# EAGLE design wally (EAGLE 9.6.2)
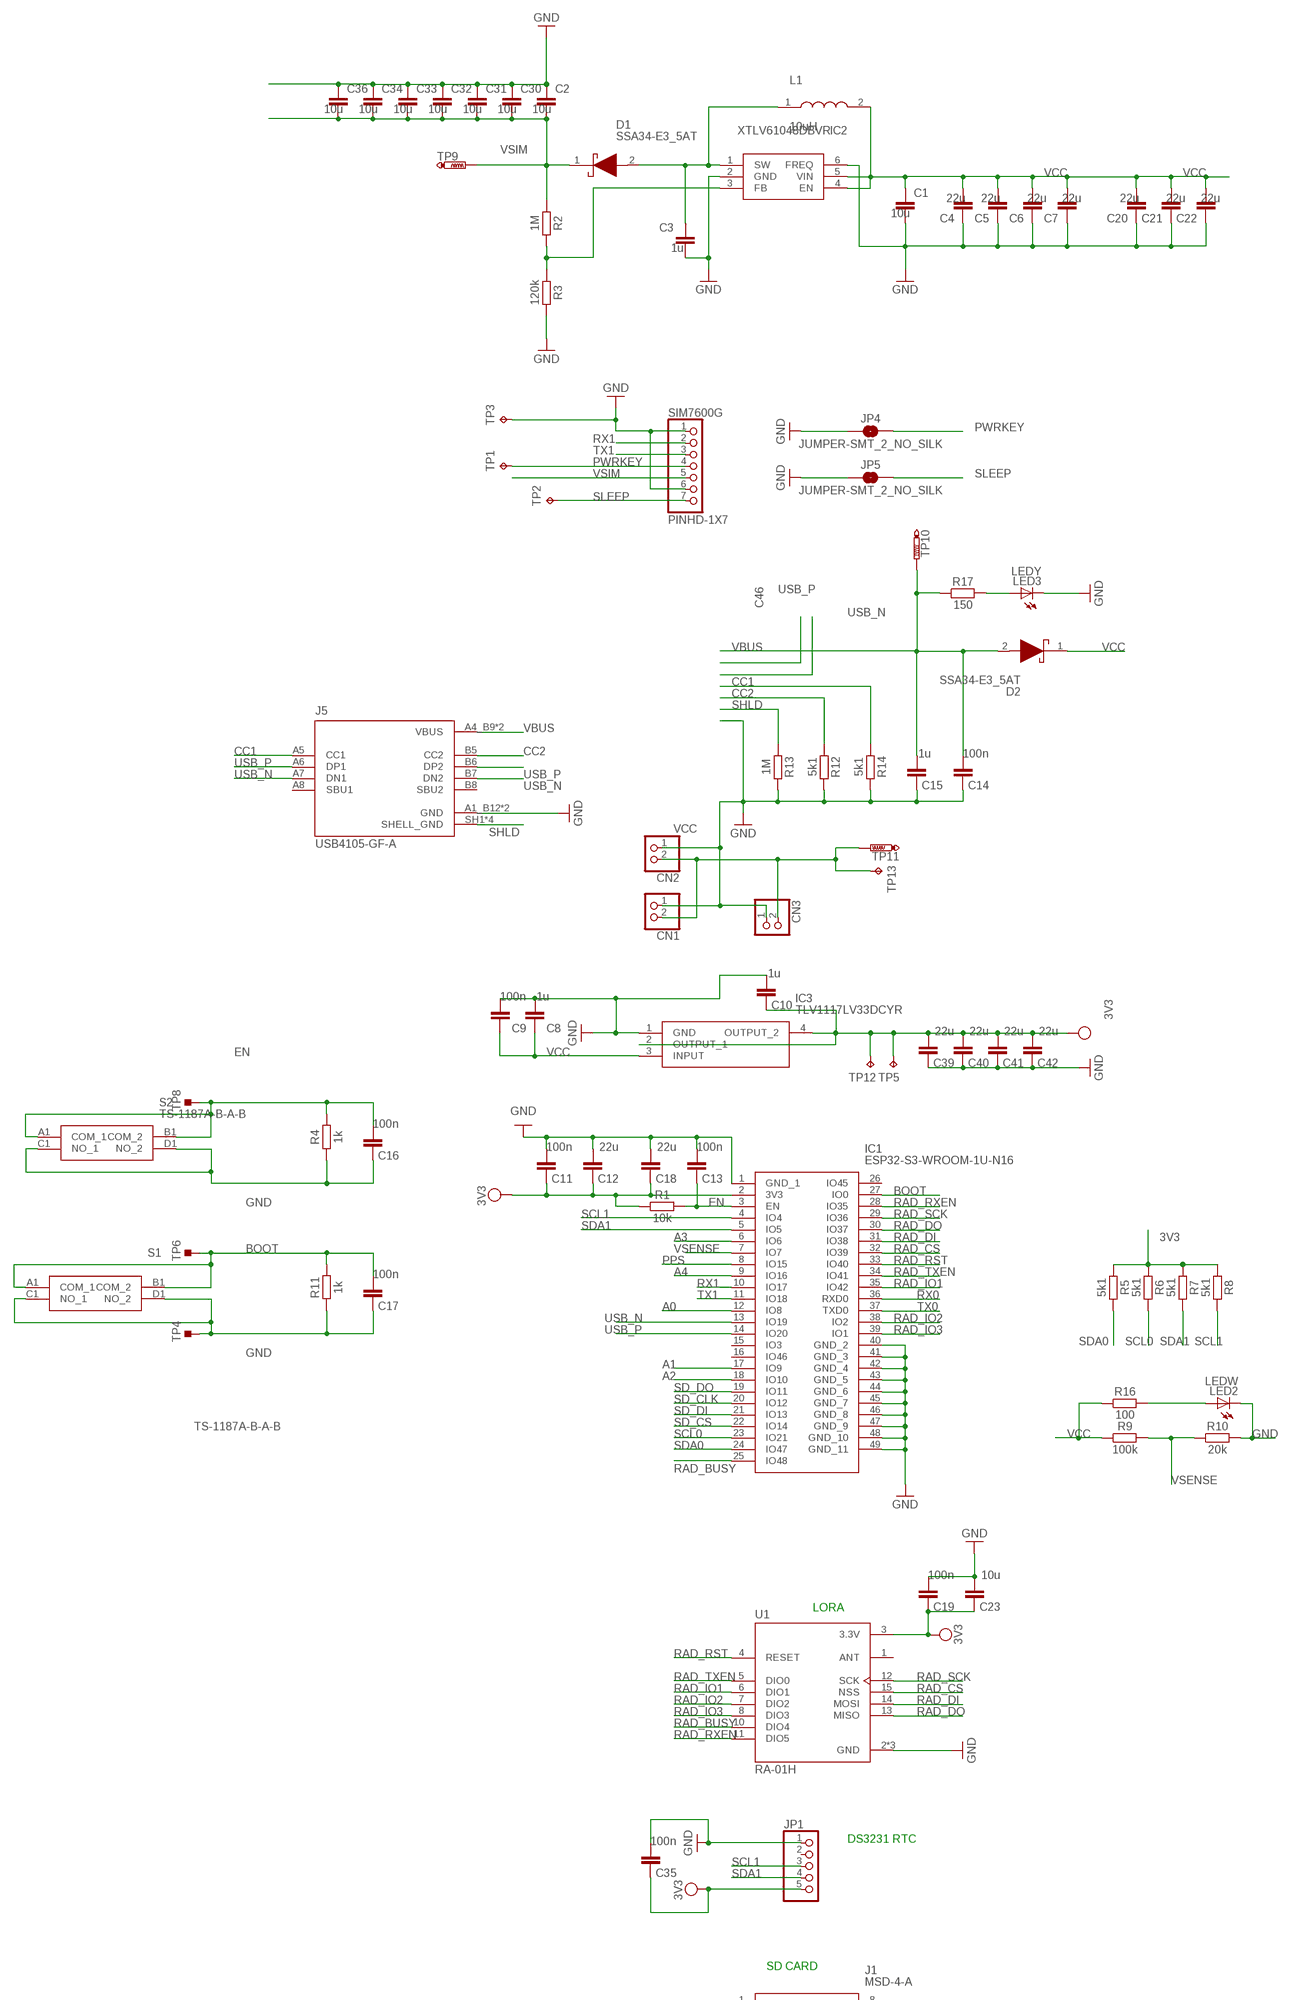
[diagram p0: schematic, sheet 1, part 1 of 2]
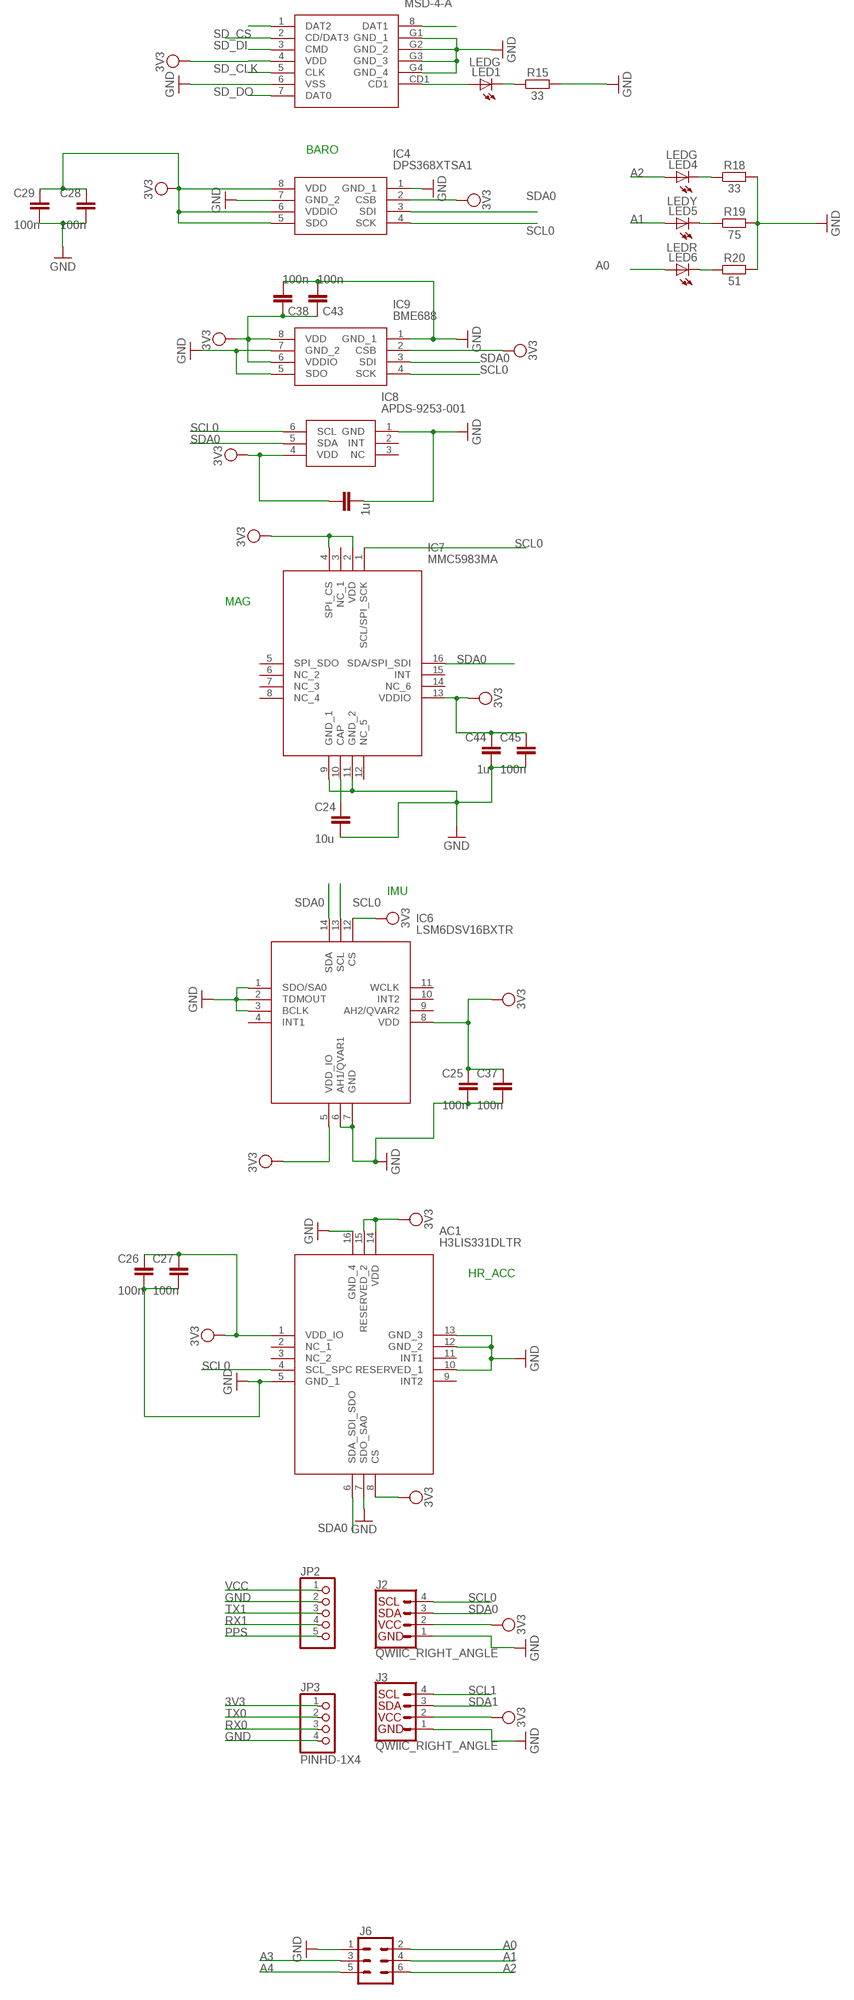
[diagram p1: schematic, sheet 1, part 2 of 2]

## Parts
AC1  H3LIS331DLTR  [LIS3DHTR]
C1  10u  C_CHIP-0402(1005-METRIC)  [CAPC1005X60]
C2  10u  C_CHIP-0603(1608-METRIC)  [CAPC1608X85]
C3  1u  C_CHIP-0402(1005-METRIC)  [CAPC1005X60]
C4  22u  C_CHIP-0603(1608-METRIC)  [CAPC1608X85]
C5  22u  C_CHIP-0603(1608-METRIC)  [CAPC1608X85]
C6  22u  C_CHIP-0603(1608-METRIC)  [CAPC1608X85]
C7  22u  C_CHIP-0603(1608-METRIC)  [CAPC1608X85]
C8  1u  C_CHIP-0402(1005-METRIC)  [CAPC1005X60]
C9  100n  C_CHIP-0402(1005-METRIC)  [CAPC1005X60]
C10  1u  C_CHIP-0402(1005-METRIC)  [CAPC1005X60]
C11  100n  C_CHIP-0402(1005-METRIC)  [CAPC1005X60]
C12  22u  C_CHIP-0603(1608-METRIC)  [CAPC1608X85]
C13  100n  C_CHIP-0402(1005-METRIC)  [CAPC1005X60]
C14  100n  C_CHIP-0402(1005-METRIC)  [CAPC1005X60]
C15  1u  C_CHIP-0402(1005-METRIC)  [CAPC1005X60]
C16  100n  C_CHIP-0402(1005-METRIC)  [CAPC1005X60]
C17  100n  C_CHIP-0402(1005-METRIC)  [CAPC1005X60]
C18  22u  C_CHIP-0603(1608-METRIC)  [CAPC1608X85]
C19  100n  C_CHIP-0402(1005-METRIC)  [CAPC1005X60]
C20  22u  C_CHIP-0603(1608-METRIC)  [CAPC1608X85]
C21  22u  C_CHIP-0603(1608-METRIC)  [CAPC1608X85]
C22  22u  C_CHIP-0603(1608-METRIC)  [CAPC1608X85]
C23  10u  C_CHIP-0402(1005-METRIC)  [CAPC1005X60]
C24  10u  C_CHIP-0402(1005-METRIC)  [CAPC1005X60]
C25  100n  C_CHIP-0402(1005-METRIC)  [CAPC1005X60]
C26  100n  C_CHIP-0402(1005-METRIC)  [CAPC1005X60]
C27  100n  C_CHIP-0402(1005-METRIC)  [CAPC1005X60]
C28  100n  C_CHIP-0402(1005-METRIC)  [CAPC1005X60]
C29  100n  C_CHIP-0402(1005-METRIC)  [CAPC1005X60]
C30  10u  C_CHIP-0603(1608-METRIC)  [CAPC1608X85]
C31  10u  C_CHIP-0603(1608-METRIC)  [CAPC1608X85]
C32  10u  C_CHIP-0603(1608-METRIC)  [CAPC1608X85]
C33  10u  C_CHIP-0603(1608-METRIC)  [CAPC1608X85]
C34  10u  C_CHIP-0603(1608-METRIC)  [CAPC1608X85]
C35  100n  C_CHIP-0402(1005-METRIC)  [CAPC1005X60]
C36  10u  C_CHIP-0603(1608-METRIC)  [CAPC1608X85]
C37  100n  C_CHIP-0402(1005-METRIC)  [CAPC1005X60]
C38  100n  C_CHIP-0402(1005-METRIC)  [CAPC1005X60]
C39  22u  C_CHIP-0603(1608-METRIC)  [CAPC1608X85]
C40  22u  C_CHIP-0603(1608-METRIC)  [CAPC1608X85]
C41  22u  C_CHIP-0603(1608-METRIC)  [CAPC1608X85]
C42  22u  C_CHIP-0603(1608-METRIC)  [CAPC1608X85]
C43  100n  C_CHIP-0402(1005-METRIC)  [CAPC1005X60]
C44  1u  C_CHIP-0402(1005-METRIC)  [CAPC1005X60]
C45  100n  C_CHIP-0402(1005-METRIC)  [CAPC1005X60]
C46  1u  C_CHIP-0402(1005-METRIC)  [CAPC1005X60]
CN1  JST_2PIN-THM-RA  [JST-PH-2-THM-RA]
CN2  JST_2PIN-THM-RA  [JST-PH-2-THM-RA]
CN3  JST_2PIN-THM-RA  [JST-PH-2-THM-RA]
D1  SSA34-E3_5AT  [DIOM5127X229N]
D2  SSA34-E3_5AT  [DIOM5127X229N]
IC1  ESP32-S3-WROOM-1U-N16  [ESP32S3WROOM1UN16]
IC2  XTLV61048DBVR  [SOT95P280X145-6N]
IC3  TLV1117LV33DCYR  [SOT230P700X180-4N]
IC4  DPS368XTSA1  [DPS368XTSA1]
IC6  LSM6DSV16BXTR  [LSM6DSV16BXTR]
IC7  MMC5983MA  [MMC5983MA]
IC8  APDS-9253-001  [APDS9253001]
IC9  BME688  [BME688]
J1  MSD-4-A  [MSD4A]
J2  QWIIC_RIGHT_ANGLE  QWIIC_CONNECTORJS-1MM  [JST04_1MM_RA]
J3  QWIIC_RIGHT_ANGLE  QWIIC_CONNECTORJS-1MM  [JST04_1MM_RA]
J5  USB4105-GF-A  [GCT_USB4105-GF-A]
J6  FEMALE 2x3  CONN_03X2NO_SILK  [2X3-NS]
JP1  PINHD-1X5  [1X05]
JP2  PINHD-1X5  [1X05]
JP3  PINHD-1X4  [1X04]
JP4  JUMPER-SMT_2_NO_SILK  [SMT-JUMPER_2_NO_SILK]
JP5  JUMPER-SMT_2_NO_SILK  [SMT-JUMPER_2_NO_SILK]
L1  10uH  BMRF00060630100MA1  [BMRF00060630100MA1]
LED1  LEDG  LEDCHIPLED_0805  [CHIPLED_0805]
LED2  LEDW  LEDCHIPLED_0805  [CHIPLED_0805]
LED3  LEDY  LEDCHIPLED_0805  [CHIPLED_0805]
LED4  LEDG  LEDCHIPLED_0805  [CHIPLED_0805]
LED5  LEDY  LEDCHIPLED_0805  [CHIPLED_0805]
LED6  LEDR  LEDCHIPLED_0805  [CHIPLED_0805]
R1  10k  R_CHIP-0402(1005-METRIC)  [RESC1005X40]
R2  1M  R_CHIP-0603(1608-METRIC)  [RESC1608X60]
R3  120k  R_CHIP-0603(1608-METRIC)  [RESC1608X60]
R4  1k  R_CHIP-0402(1005-METRIC)  [RESC1005X40]
R5  5k1  R_CHIP-0402(1005-METRIC)  [RESC1005X40]
R6  5k1  R_CHIP-0402(1005-METRIC)  [RESC1005X40]
R7  5k1  R_CHIP-0402(1005-METRIC)  [RESC1005X40]
R8  5k1  R_CHIP-0402(1005-METRIC)  [RESC1005X40]
R9  100k  R_CHIP-0402(1005-METRIC)  [RESC1005X40]
R10  20k  R_CHIP-0402(1005-METRIC)  [RESC1005X40]
R11  1k  R_CHIP-0402(1005-METRIC)  [RESC1005X40]
R12  5k1  R_CHIP-0603(1608-METRIC)  [RESC1608X60]
R13  1M  R_CHIP-0402(1005-METRIC)  [RESC1005X40]
R14  5k1  R_CHIP-0603(1608-METRIC)  [RESC1608X60]
R15  33  R_CHIP-0402(1005-METRIC)  [RESC1005X40]
R16  100  R_CHIP-0402(1005-METRIC)  [RESC1005X40]
R17  150  R_CHIP-0603(1608-METRIC)  [RESC1608X60]
R18  33  R_CHIP-0402(1005-METRIC)  [RESC1005X40]
R19  75  R_CHIP-0603(1608-METRIC)  [RESC1608X60]
R20  51  R_CHIP-0603(1608-METRIC)  [RESC1608X60]
S1  TS-1187A-B-A-B  [TS1187ABAB]
S2  TS-1187A-B-A-B  [TS1187ABAB]
SIM7600G  PINHD-1X7  [1X07]
TP1  TPPAD1-13  [P1-13]
TP2  TPPAD1-13  [P1-13]
TP3  TPPAD1-13  [P1-13]
TP4  TESTPOINT_TPS-PAD-036  [TESTPOINT_PAD-036]
TP5  TPPAD1-13  [P1-13]
TP6  TESTPOINT_TPS-PAD-036  [TESTPOINT_PAD-036]
TP8  TESTPOINT_TPS-PAD-036  [TESTPOINT_PAD-036]
TP9  PTR1PAD1-13  [P1-13]
TP10  PTR1PAD1-13  [P1-13]
TP11  PTR1PAD1-13  [P1-13]
TP12  TPPAD1-13  [P1-13]
TP13  TPPAD1-13  [P1-13]
U1  RA-01H  [XCVR_RA-01H]

## Nets
3V3: AC1.1(VDD_IO) AC1.8(CS) AC1.14(VDD) AC1.15(RESERVED_2) C10.1 C11.1 C12.1 C18.1 C19.1 C23.1 C25.1 C26.1 C27.1 C28.1 C29.1 C35.1 C37.1 C38.1 C39.2 C40.2 C41.2 C42.2 C43.1 C44.1 C45.1 C46.1 IC1.2(3V3) IC3.2(OUTPUT_1) IC3.4(OUTPUT_2) IC4.2(CSB) IC4.5(SDO) IC4.6(VDDIO) IC4.8(VDD) IC6.5(VDD_IO) IC6.8(VDD) IC6.12(CS) IC7.2(VDD) IC7.4(SPI_CS) IC7.13(VDDIO) IC8.4(VDD) IC9.2(CSB) IC9.6(VDDIO) IC9.8(VDD) J1.4(VDD) J2.2 J3.2 JP1.5 JP3.1 R1.1 R5.1 R6.1 R7.1 R8.1 TP5.TP TP12.TP U1.3(3.3V)
A0: IC1.12(IO8) J6.2 LED6.A
A1: IC1.17(IO9) J6.4 LED5.A
A2: IC1.18(IO10) J6.6 LED4.A
A3: IC1.6(IO6) J6.3
A4: IC1.9(IO16) J6.5
BOOT: C17.2 IC1.27(IO0) R11.2 S1.A1(COM_1) S1.B1(COM_2) TP6.1(TP)
CC1: J5.A5(CC1) R14.1
CC2: J5.B5(CC2) R12.1
EN: C13.1 C16.2 IC1.3(EN) R1.2 R4.2 S2.A1(COM_1) S2.B1(COM_2) TP8.1(TP)
GND: AC1.5(GND_1) AC1.7(SDO_SA0) AC1.10(RESERVED_1) AC1.12(GND_2) AC1.13(GND_3) AC1.16(GND_4) C1.2 C2.1 C3.2 C4.1 C5.1 C6.1 C7.1 C8.2 C9.2 C10.2 C11.2 C12.2 C13.2 C14.1 C15.1 C16.1 C17.1 C18.2 C19.2 C20.1 C21.1 C22.1 C23.2 C24.2 C25.2 C26.2 C27.2 C28.2 C29.2 C30.1 C31.1 C32.1 C33.1 C34.1 C35.2 C36.1 C37.2 C38.2 C39.1 C40.1 C41.1 C42.1 C43.2 C44.2 C45.2 C46.2 CN1.1 CN2.1 CN3.1 IC1.1(GND_1) IC1.40(GND_2) IC1.41(GND_3) IC1.42(GND_4) IC1.43(GND_5) IC1.44(GND_6) IC1.45(GND_7) IC1.46(GND_8) IC1.47(GND_9) IC1.48(GND_10) IC1.49(GND_11) IC2.2(GND) IC2.6(FREQ) IC3.1(GND) IC4.1(GND_1) IC4.7(GND_2) IC6.1(SDO/SA0) IC6.2(TDMOUT) IC6.3(BCLK) IC6.6(AH1/QVAR1) IC6.7(GND) IC7.9(GND_1) IC7.11(GND_2) IC8.1(GND) IC9.1(GND_1) IC9.5(SDO) IC9.7(GND_2) J1.6(VSS) J1.G1(GND_1) J1.G2(GND_2) J1.G3(GND_3) J1.G4(GND_4) J2.1 J3.1 J5.A1_B12(GND) J5.B1_A12(GND) J6.1 JP1.1 JP2.2 JP3.4 JP4.1 JP5.1 LED2.C LED3.C R3.2 R4.1 R10.2 R11.1 R12.2 R13.2 R14.2 R15.2 R18.2 R19.2 R20.2 S1.C1(NO_1) S1.D1(NO_2) S2.C1(NO_1) S2.D1(NO_2) SIM7600G.1 SIM7600G.6 TP3.TP TP4.1(TP) U1.2(GND) U1.9(GND) U1.16(GND)
N$1: LED1.C R15.1
N$2: C3.1 D1.2(A) IC2.1(SW) L1.1
N$3: IC2.3(FB) R2.2 R3.1
N$4: LED3.A R17.2
N$6: C24.1 IC7.10(CAP)
N$7: LED4.C R18.1
N$8: LED5.C R19.1
N$9: LED2.A R16.2
N$10: J1.8(DAT1)
N$11: LED6.C R20.1
N$13: J1.1(DAT2)
N$49: J1.CD1 LED1.A
PPS: IC1.8(IO15) JP2.5
PWRKEY: JP4.2 SIM7600G.4 TP1.TP
RAD_BUSY: IC1.25(IO48) U1.10(DIO4)
RAD_CS: IC1.32(IO39) U1.15(NSS)
RAD_DI: IC1.31(IO38) U1.14(MOSI)
RAD_DO: IC1.30(IO37) U1.13(MISO)
RAD_IO1: IC1.35(IO42) U1.6(DIO1)
RAD_IO2: IC1.38(IO2) U1.7(DIO2)
RAD_IO3: IC1.39(IO1) U1.8(DIO3)
RAD_RST: IC1.33(IO40) U1.4(RESET)
RAD_RXEN: IC1.28(IO35) U1.11(DIO5)
RAD_SCK: IC1.29(IO36) U1.12(SCK)
RAD_TXEN: IC1.34(IO41) U1.5(DIO0)
RX0: IC1.36(RXD0) JP3.3
RX1: IC1.10(IO17) JP2.4 SIM7600G.2
SCL0: AC1.4(SCL_SPC) IC1.23(IO21) IC4.4(SCK) IC6.13(SCL) IC7.1(SCL/SPI_SCK) IC8.6(SCL) IC9.4(SCK) J2.4 R6.2
SCL1: IC1.4(IO4) J3.4 JP1.3 R8.2
SD_CLK: IC1.20(IO12) J1.5(CLK)
SD_CS: IC1.22(IO14) J1.2(CD/DAT3)
SD_DI: IC1.21(IO13) J1.3(CMD)
SD_DO: IC1.19(IO11) J1.7(DAT0)
SDA0: AC1.6(SDA_SDI_SDO) IC1.24(IO47) IC4.3(SDI) IC6.14(SDA) IC7.16(SDA/SPI_SDI) IC8.5(SDA) IC9.3(SDI) J2.3 R5.2
SDA1: IC1.5(IO5) J3.3 JP1.4 R7.2
SHLD: J5.SH1(SHELL_GND) J5.SH2(SHELL_GND) J5.SH3(SHELL_GND) J5.SH4(SHELL_GND) R13.1
SLEEP: JP5.2 SIM7600G.7 TP2.TP
TX0: IC1.37(TXD0) JP3.2
TX1: IC1.11(IO18) JP2.3 SIM7600G.3
USB_N: IC1.13(IO19) J5.A7(DN1) J5.B7(DN2)
USB_P: IC1.14(IO20) J5.A6(DP1) J5.B6(DP2)
VBUS: C14.2 C15.2 D2.2(A) J5.A4_B9(VBUS) J5.B4_A9(VBUS) R17.1 TP10.TP
VCC: C1.1 C4.2 C5.2 C6.2 C7.2 C8.1 C9.1 C20.2 C21.2 C22.2 CN1.2 CN2.2 CN3.2 D2.1(K) IC2.4(EN) IC2.5(VIN) IC3.3(INPUT) JP2.1 L1.2 R9.1 R16.1 TP11.TP TP13.TP
VSENSE: IC1.7(IO7) R9.2 R10.1
VSIM: C2.2 C30.2 C31.2 C32.2 C33.2 C34.2 C36.2 D1.1(K) R2.1 SIM7600G.5 TP9.TP
Unconnected: AC1.2(NC_1) AC1.3(NC_2) AC1.9(INT2) AC1.11(INT1) IC1.15(IO3) IC1.16(IO46) IC1.26(IO45) IC6.4(INT1) IC6.9(AH2/QVAR2) IC6.10(INT2) IC6.11(WCLK) IC7.3(NC_1) IC7.5(SPI_SDO) IC7.6(NC_2) IC7.7(NC_3) IC7.8(NC_4) IC7.12(NC_5) IC7.14(NC_6) IC7.15(INT) IC8.2(INT) IC8.3(NC) J5.A8(SBU1) J5.B8(SBU2) JP1.2 U1.1(ANT)

## Notes on the sheet
- LORA
- DS3231 RTC
- SD CARD
- BARO
- MAG
- IMU
- HR_ACC

## Library data of the parts
AC1 = SamacSys_Parts:H3LIS331DLTR: Accelerometers Low Pwr Hi G 3-axis Digital Acceleromtr Source: Datasheet <http://www.st.com/st-web-ui/static/active/en/resource/technical/document/datasheet/DM00053090.pdf>; ARROW_PART_NUMBER: H3LIS331DLTR; ARROW_PRICE-STOCK: https://www.arrow.com/en/products/h3lis331dltr/stmicroelectronics?region=nac; DESCRIPTION: Accelerometers Low Pwr Hi G 3-axis Digital Acceleromtr; HEIGHT: 1mm; MANUFACTURER_NAME: STMicroelectronics; MANUFACTURER_PART_NUMBER: H3LIS331DLTR; MOUSER_PART_NUMBER: 511-H3LIS331DLTR; MOUSER_PRICE-STOCK: https://www.mouser.co.uk/ProductDetail/STMicroelectronics/H3LIS331DLTR?qs=TAo1I7FhABsAZFqkqNUSRA%3D%3D
C1-C46 = Capacitor:C: Capacitor - Generic; CATEGORY: Capacitor
CN1-CN3 = adafruit:JST_2PIN: JST 2-Pin Connectors of various flavors SMT-RA (S2B-PH-SM4) 4UConnector #17311 SMT (B2B-PH-SM4) THM-RA (S2B-PH) THM (B2B-PH)
D1 D2 = SamacSys_Parts:SSA34-E3_5AT: Vishay SSA34-E3/5AT, SMT Schottky Diode, 40V 3A, 2-Pin DO-214AC Source: Datasheet <https://www.vishay.com/docs/88883/ssa33l.pdf>; ARROW_PART_NUMBER: SSA34-E3/5AT; ARROW_PRICE-STOCK: https://www.arrow.com/en/products/ssa34-e35at/vishay?region=nac; DESCRIPTION: Vishay SSA34-E3/5AT, SMT Schottky Diode, 40V 3A, 2-Pin DO-214AC; HEIGHT: 2.29mm; MANUFACTURER_NAME: Vishay; MANUFACTURER_PART_NUMBER: SSA34-E3/5AT; MOUSER_PART_NUMBER: 625-SSA34-E3/5AT; MOUSER_PRICE-STOCK: https://www.mouser.co.uk/ProductDetail/Vishay-General-Semiconductor/SSA34-E3-5AT?qs=x2jpVgRnAtMCobuyGDc8VQ%3D%3D
IC1 = SamacSys_Parts:ESP32-S3-WROOM-1U-N16: Multiprotocol Modules SMD Module, ESP32-S3, 16 MB SPI Flash, IPEX Antenna Connector Source: Datasheet <https://www.espressif.com/sites/default/files/documentation/esp32-s3-wroom-1_wroom-1u_datasheet_en.pdf>; DESCRIPTION: Multiprotocol Modules SMD Module, ESP32-S3, 16 MB SPI Flash, IPEX Antenna Connector; HEIGHT: 3.35mm; MANUFACTURER_NAME: Espressif Systems; MANUFACTURER_PART_NUMBER: ESP32-S3-WROOM-1U-N16; MOUSER_PART_NUMBER: 356-ESP32S3WROM1UN16; MOUSER_PRICE-STOCK: https://www.mouser.co.uk/ProductDetail/Espressif-Systems/ESP32-S3-WROOM-1U-N16?qs=Li%252BoUPsLEntAI1ynUyotnA%3D%3D
IC2 = SamacSys_Parts:XTLV61048DBVR: 15-V output voltage non-synchronous boost converter in SOT-23 package Source: Datasheet <https://pdf1.alldatasheet.com/datasheet-pdf/view/1134744/TI1/XTLV61048DBVR.html>; DESCRIPTION: 15-V output voltage non-synchronous boost converter in SOT-23 package; HEIGHT: 1.45mm; MANUFACTURER_NAME: Texas Instruments; MANUFACTURER_PART_NUMBER: XTLV61048DBVR; MOUSER_PART_NUMBER: N/A; MOUSER_PRICE-STOCK: https://www.mouser.com/Search/Refine.aspx?Keyword=N%2FA
IC3 = SamacSys_Parts:TLV1117LV33DCYR: 1-A, Positive Fixed Voltage, Low-Dropout Regulator Source: Datasheet <http://www.ti.com/lit/gpn/tlv1117lv>; ARROW_PART_NUMBER: TLV1117LV33DCYR; ARROW_PRICE-STOCK: https://www.arrow.com/en/products/tlv1117lv33dcyr/texas-instruments?region=nac; DESCRIPTION: 1-A, Positive Fixed Voltage, Low-Dropout Regulator; HEIGHT: 1.8mm; MANUFACTURER_NAME: Texas Instruments; MANUFACTURER_PART_NUMBER: TLV1117LV33DCYR; MOUSER_PART_NUMBER: 595-TLV1117LV33DCYR; MOUSER_PRICE-STOCK: https://www.mouser.co.uk/ProductDetail/Texas-Instruments/TLV1117LV33DCYR?qs=tEz3BkPb1rwzXMb8FiWhow%3D%3D
IC4 = SamacSys_Parts:DPS368XTSA1: Infineon PRESSURE SENSOR Source: Datasheet <https://www.infineon.com/dgdl/Infineon-DPS368-DataSheet-v01_01-EN.pdf?fileId=5546d46269e1c019016a0c45105d4b40>; ARROW_PART_NUMBER: DPS368XTSA1; ARROW_PRICE-STOCK: https://www.arrow.com/en/products/dps368xtsa1/infineon-technologies-ag?region=nac; DESCRIPTION: Infineon PRESSURE SENSOR; HEIGHT: 1.1mm; MANUFACTURER_NAME: Infineon; MANUFACTURER_PART_NUMBER: DPS368XTSA1; MOUSER_PART_NUMBER: 726-DPS368XTSA1; MOUSER_PRICE-STOCK: https://www.mouser.co.uk/ProductDetail/Infineon-Technologies/DPS368XTSA1?qs=l7cgNqFNU1issZx9oeCNag%3D%3D
IC6 = SamacSys_Parts:LSM6DSV16BXTR: iNEMO inertial module: 3D accelerometer and 3D gyroscope Source: Datasheet <https://www.st.com/resource/en/datasheet/lsm6dsv16bx.pdf>; ARROW_PART_NUMBER: LSM6DSV16BXTR; ARROW_PRICE-STOCK: https://www.arrow.com/en/products/lsm6dsv16bxtr/stmicroelectronics?region=nac; DESCRIPTION: iNEMO inertial module: 3D accelerometer and 3D gyroscope; HEIGHT: 0.74mm; MANUFACTURER_NAME: STMicroelectronics; MANUFACTURER_PART_NUMBER: LSM6DSV16BXTR; MOUSER_PART_NUMBER: 511-LSM6DSV16BXTR; MOUSER_PRICE-STOCK: https://www.mouser.co.uk/ProductDetail/STMicroelectronics/LSM6DSV16BXTR?qs=vvQtp7zwQdMXKB4RqH7GHQ%3D%3D
IC7 = SamacSys_Parts:MMC5983MA: 3-AXIS MAGNETIC SENSOR Source: Datasheet <https://www.mouser.com/datasheet/2/821/Memsic_09102019_MMC5983MA_Datasheet_Rev_A-1635338.pdf>; ARROW_PART_NUMBER: MMC5983MA; ARROW_PRICE-STOCK: https://www.arrow.com/en/products/mmc5983ma/memsic?region=europe; DESCRIPTION: 3-AXIS MAGNETIC SENSOR; HEIGHT: 1mm; MANUFACTURER_NAME: MEMSIC; MANUFACTURER_PART_NUMBER: MMC5983MA; MOUSER_PART_NUMBER: 438-MMC5983MA; MOUSER_PRICE-STOCK: https://www.mouser.co.uk/ProductDetail/MEMSIC/MMC5983MA?qs=B6kkDfuK7%2FD5qasHMdEt2g%3D%3D
IC8 = SamacSys_Parts:APDS-9253-001: APDS-9253-001 Broadcom, Ambient Light Sensor, Ambient Light 470 (Blue) nm, 550 (Green) nm, 610 (Red) nm I2C 6-Pin ODFN Source: Datasheet <https://docs.broadcom.com/docs/APDS-9253-001-DS>; DESCRIPTION: APDS-9253-001 Broadcom, Ambient Light Sensor, Ambient Light 470 (Blue) nm, 550 (Green) nm, 610 (Red) nm I2C 6-Pin ODFN; HEIGHT: 0.7mm; MANUFACTURER_NAME: Avago Technologies; MANUFACTURER_PART_NUMBER: APDS-9253-001; MOUSER_PART_NUMBER: 630-APDS-9253-001; MOUSER_PRICE-STOCK: https://www.mouser.co.uk/ProductDetail/Broadcom-Avago/APDS-9253-001?qs=T3oQrply3y9os9rwnJ1p%252Bg%3D%3D
IC9 = SamacSys_Parts:BME688: Gas sensor measuring relative humidity, barometric pressure, ambient temperature and gas (VOC) Source: Datasheet <https://www.bosch-sensortec.com/media/boschsensortec/downloads/datasheets/bst-bme688-ds000.pdf>; ARROW_PART_NUMBER: BME688; ARROW_PRICE-STOCK: https://www.arrow.com/en/products/bme688/bosch?region=europe; DESCRIPTION: Gas sensor measuring relative humidity, barometric pressure, ambient temperature and gas (VOC); HEIGHT: 1mm; MANUFACTURER_NAME: BOSCH; MANUFACTURER_PART_NUMBER: BME688; MOUSER_PART_NUMBER: 262-BME688; MOUSER_PRICE-STOCK: https://www.mouser.co.uk/ProductDetail/Bosch-Sensortec/BME688?qs=IS%252B4QmGtzzqQoVDscqwx3A%3D%3D
J1 = SamacSys_Parts:MSD-4-A: Memory Card Connectors 9 Positions, Push In, Auto Eject Out, SMT, 1.8 mm Height Above Board, Source: Datasheet <https://www.cuidevices.com/product/resource/pdf/msd-4-a.pdf>; DESCRIPTION: Memory Card Connectors 9 Positions, Push In, Auto Eject Out, SMT, 1.8 mm Height Above Board,; HEIGHT: 2mm; MANUFACTURER_NAME: CUI Devices; MANUFACTURER_PART_NUMBER: MSD-4-A; MOUSER_PART_NUMBER: 179-MSD-4-A; MOUSER_PRICE-STOCK: https://www.mouser.co.uk/ProductDetail/CUI-Devices/MSD-4-A?qs=Z%252BL2brAPG1Jll%252BQTi%252Btupg%3D%3D
J2 J3 = SparkFun-Connectors:QWIIC_CONNECTOR: SparkFun I2C Standard Qwiic Connector An SMD 1mm pitch JST connector makes it easy and quick (get it? Qwiic?) to connect I2C devices to each other. The Qwiic system <http://www.sparkfun.com/qwiic> enables fast and solderless connection between popular platforms and various sensors and actuators. We carry 200mm <https://www.sparkfun.com/products/14204>, 100mm <https://www.sparkfun.com/products/14205>, 50mm <https://www.sparkfun.com/products/14206>, and breadboard friendly <https://www.sparkfun.com/products/14207> Qwiic cables. We also offer 10 pcs strips <https://www.sparkfun.com/products/14323> the SMD connectors.; PROD_ID: CONN-13694
J5 = USB4105-GF-A:USB4105-GF-A; CHECK_PRICES: https://www.snapeda.com/parts/USB4105GFA/Global+Connector+Technology/view-part/?ref=eda; DESCRIPTION: USB-C (USB TYPE-C) USB 2.0 Receptacle Connector 24 (16+8 Dummy) Position Surface Mount, Right Angle; Through Hole; DIGIKEY_PART_NUMBER: 2073-USB4105-GF-ATR-ND; MF: Global Connector Technology; MP: USB4105GFA; PACKAGE: None; SNAPEDA_LINK: https://www.snapeda.com/parts/USB4105GFA/Global+Connector+Technology/view-part/?ref=snap
J6 = SparkFun-Connectors:CONN_03X2: Multi connection point. Often used as Generic Header-pin footprint for 0.1 inch spaced/style header connections You can populate with any combo of single row headers, but if you'd like an exact match, check these: Header - 2x3 (Male, 0.1") <https://www.sparkfun.com/products/12807> (PRT-12807) Header - 2x3 (Female, 0.1") <https://www.sparkfun.com/products/13010> (PRT-13010) 2x3 Pin Shrouded Header <https://www.sparkfun.com/products/10877> (PRT-10877) On any of the 0.1 inch spaced packages, you can populate with these: Break Away Headers - Straight <https://www.sparkfun.com/products/116> (PRT-00116) Break Away Male Headers - Right Angle <https://www.sparkfun.com/products/553> (PRT-00553) Female Headers <https://www.sparkfun.com/products/115> (PRT-00115) Break Away Headers - Machine Pin <https://www.sparkfun.com/products/117> (PRT-00117) Break Away Female Headers - Swiss Machine Pin <https://www.sparkfun.com/products/743> (PRT-00743) Special note: the shrouded connector mates well with our 3x2 ribbon cables: Ribbon Crimp Connector - 6-pin (2x3, Female) <https://www.sparkfun.com/products/10651> (PRT-10651) Ribbon Cable - 6 wire (15ft) <https://www.sparkfun.com/products/10646> (PRT-10646)
JP1 JP2 = pinhead:PINHD-1X5: PIN HEADER
JP3 = Connector:PINHD-1X4: PIN HEADER; CATEGORY: Headers; DESCRIPTION: Header, Straight, 4 Position; MANUFACTURER: Generic; MPN: Generic; OPERATING_TEMPERATURE: Generic; PART_STATUS: Active; PITCH: 0.100" (2.54mm); ROHS_COMPLIANCE: Generic; SERIES: Generic; SUB-CATEGORY: Headers, Male Pins; TYPE: Board to Board or Cable, Unshrouded, Through Hole, Straight
JP4 JP5 = SparkFun-Jumpers:JUMPER-SMT_2_NO: Normally open jumper This jumper has two pads in close proximity to each other. Apply solder to close the connection. Round pads are easier to solder for beginners, but are a lot larger. SparkFun Product that uses the round pads: SparkFun EL Sequencer <https://www.sparkfun.com/products/12781>
L1 = SamacSys_Parts:BMRF00060630100MA1: 10 H Shielded Molded Inductor 4 A 68mOhm Max Nonstandard Source: Datasheet <https://www.chilisin.com/upload/media/product/power/file/BMRx_Series.pdf>; DESCRIPTION: 10 H Shielded Molded Inductor 4 A 68mOhm Max Nonstandard; HEIGHT: 3mm; MANUFACTURER_NAME: Chilisin; MANUFACTURER_PART_NUMBER: BMRF00060630100MA1
LED1-LED6 = adafruit:LED: LED OSRAM: - CHIPLED LG R971, LG N971, LY N971, LG Q971, LY Q971, LO R971, LY R971 LH N974, LH R974 LS Q976, LO Q976, LY Q976 LO Q996 - Hyper CHIPLED LW Q18S LB Q993, LB Q99A, LB R99A - SideLED LS A670, LO A670, LY A670, LG A670, LP A670 LB A673, LV A673, LT A673, LW A673 LH A674 LY A675 LS A676, LA A676, LO A676, LY A676, LW A676 LS A679, LY A679, LG A679 - Hyper Micro SIDELED® LS Y876, LA Y876, LO Y876, LY Y876 LT Y87S - SmartLED LW L88C, LW L88S LB L89C, LB L89S, LG L890 LS L89K, LO L89K, LY L89K LS L896, LA L896, LO L896, LY L896 - TOPLED LS T670, LO T670, LY T670, LG T670, LP T670 LSG T670, LSP T670, LSY T670, LOP T670, LYG T670 LG T671, LOG T671, LSG T671 LB T673, LV T673, LT T673, LW T673 LH T674 LS T676, LA T676, LO T676, LY T676, LB T676, LH T676, LSB T676, LW T676 LB T67C, LV T67C, LT T67C, LS T67K, LO T67K, LY T67K, LW E67C LS E67B, LA E67B, LO E67B, LY E67B, LB E67C, LV E67C, LT E67C LW T67C LS T679, LY T679, LG T679 LS T770, LO T770, LY T770, LG T770, LP T770 LB T773, LV T773, LT T773, LW T773 LH T774 LS E675, LA E675, LY E675, LS T675 LS T776, LA T776, LO T776, LY T776, LB T776 LHGB T686 LT T68C, LB T68C - Hyper Mini TOPLED® LB M676 - Mini TOPLED Santana® LG M470 LS M47K, LO M47K, LY M47K Source: http://www.osram.convergy.de/
R1-R20 = Resistor:R: Resistor Fixed - Generic; CATEGORY: Resistor; SUB-CATEGORY: Fixed
S1 S2 = SamacSys_Parts:TS-1187A-B-A-B: tact switch 4x4X1.5 patch 160GF metal head waterproof Source: Datasheet <http://www.helloxkb.com/public/images/pdf/TS-1187A-X-X-X.pdf>; DESCRIPTION: tact switch 4x4X1.5 patch 160GF metal head waterproof; HEIGHT: 4.05mm; MANUFACTURER_NAME: XKB Connectivity; MANUFACTURER_PART_NUMBER: TS-1187A-B-A-B
SIM7600G = Connector:PINHD-1X7: PIN HEADER; CATEGORY: Headers; DESCRIPTION: Header, Straight, 7 Position; MANUFACTURER: Generic; MPN: Generic; OPERATING_TEMPERATURE: Generic; PART_STATUS: Active; PITCH: 0.100" (2.54mm); ROHS_COMPLIANCE: Generic; SERIES: Generic; SUB-CATEGORY: Headers, Male Pins; TYPE: Board to Board or Cable, Unshrouded, Through Hole, Straight
TP1-TP3 TP5 TP12 TP13 = testpad:TP: Test pad
TP4 TP6 TP8 = 52101-101-REV-A_v16:TESTPOINT_TPS: TEST POINT PAD; BOM: EXCLUDE
TP9-TP11 = testpad:PTR1: TEST PIN
U1 = RA-01H:RA-01H: Ai-Thinker Lora Series Module Check availability <https://pricing.snapeda.com/parts/RA-01H/AI-Thinker/view-part?ref=eda>; AVAILABILITY: In Stock; CHECK_PRICES: https://www.snapeda.com/parts/RA-01H/AI-Thinker/view-part/?ref=eda; DESCRIPTION: General ISM < 1GHz LoRa™ Transceiver Module 803MHz ~ 930MHz Antenna Not Included Surface Mount; MF: AI-Thinker; MP: RA-01H; PACKAGE: Package; PRICE: None; SNAPEDA_LINK: https://www.snapeda.com/parts/RA-01H/AI-Thinker/view-part/?ref=snap

## Board
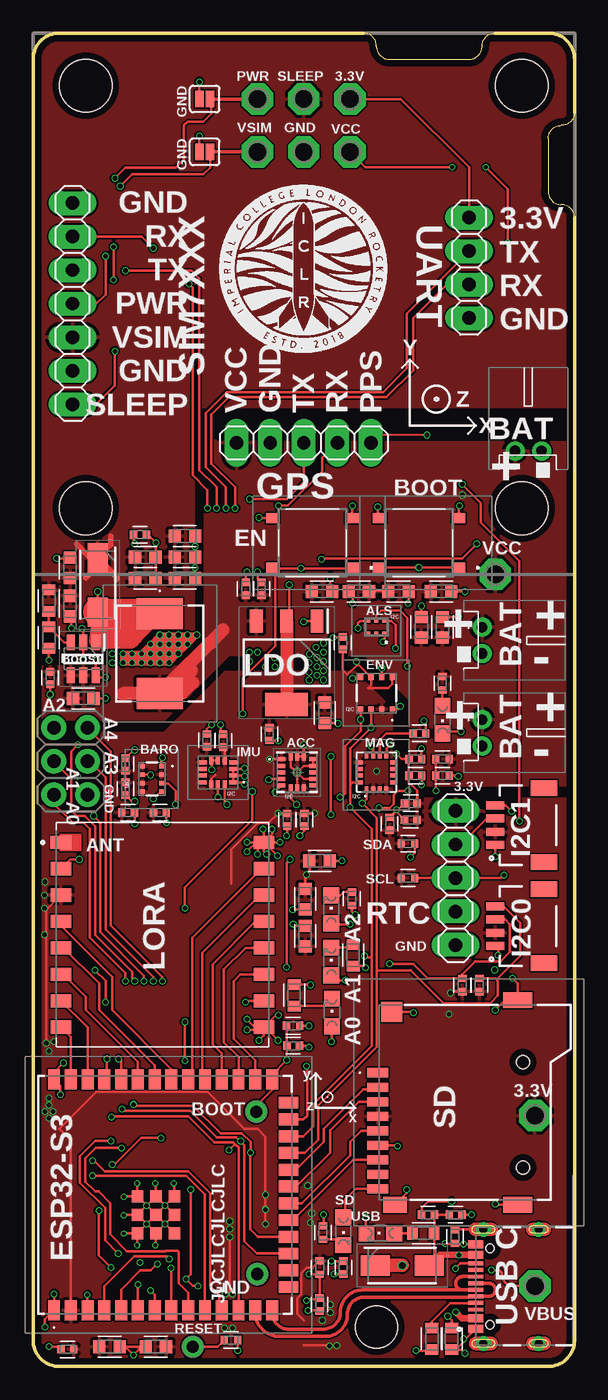
[diagram p2: board, top side]
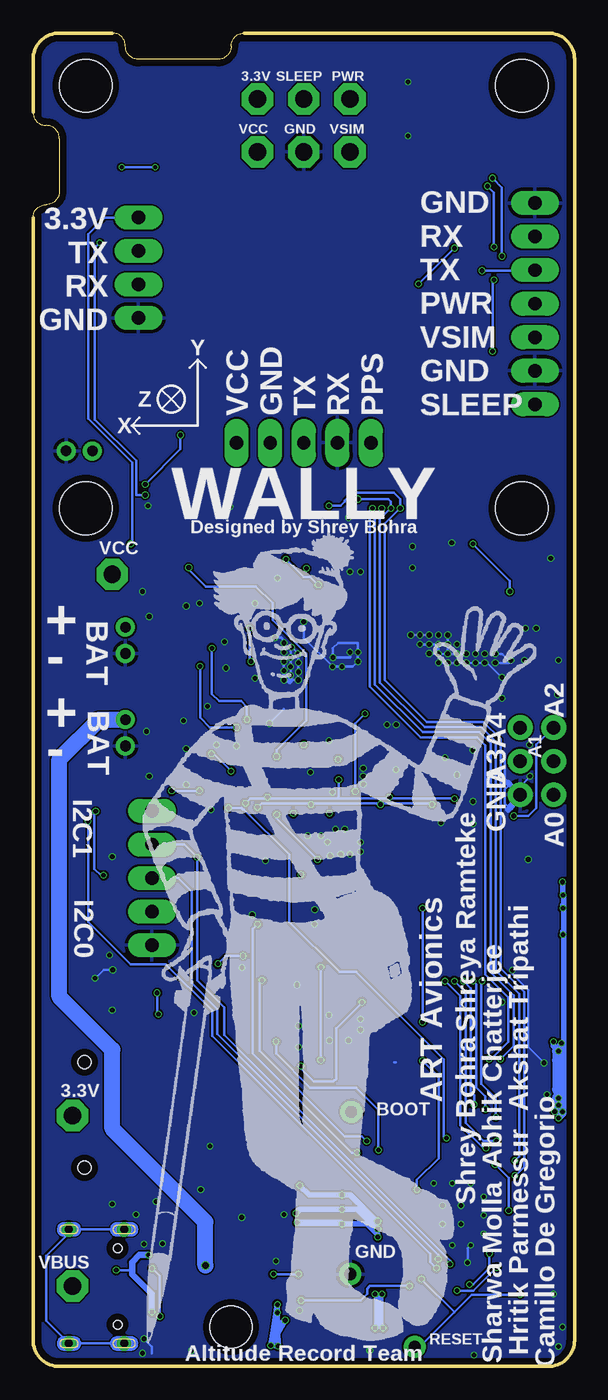
[diagram p3: board, bottom side, seen from below]

Size 41 x 101 mm. Coordinates in mm from the lower left corner, seen from the top.
Outline: 0,99 arc-90 2,101 25,101 arc-90 26,100 arc90 27,99 33,99 arc90 34,100 arc-90 35,101 39,101 arc-90 41,99 41,95 arc-90 40,94 arc90 39,93 39,89 arc90 40,88 arc-90 41,87 41,2 arc-90 39,0 2,0 arc-90 0,2 0,99
Copper layers (1*16): Top 0.035mm / dielectric 1.6mm / Bottom 0.035mm
Design rules "jlcpcb-2layers *": minimum track width 7mil, minimum drill 0.3mm, track to track 5mil, track to pad 5mil, pad to pad 5mil, via to via 5mil, smd to smd 5mil, copper to edge 0.5mm, drill to drill 6mil, minimum pad ring 10mil, minimum via ring 3mil, stop-mask expansion 4mil, vias tented up to drill 0.4mm, thermal gap 10mil
Holes 4 mm at 4,97 37,97 37,65 4,65
Holes 3.2 mm at 26,3

### Footprints (pad centres in the part's own frame; a part is rotated, then mirrored left to right if it is on the bottom)
LIS3DHTR = smd 0.6 x 0.3: 1 -1.2,1; 2 -1.2,0.5; 3 -1.2,0; 4 -1.2,-0.5; 5 -1.2,-1; 9 1.2,-1; 10 1.2,-0.5; 11 1.2,0; 12 1.2,0.5; 13 1.2,1 | smd 0.3 x 0.6: 6 -0.5,-1.2; 7 0,-1.2; 8 0.5,-1.2; 14 0.5,1.2; 15 0,1.2; 16 -0.5,1.2
CAPC1005X60 = smd 0.56 x 0.629: 1 -0.485,0; 2 0.485,0
CAPC1608X85 = smd 0.921 x 0.97: 1 -0.775,0; 2 0.775,0
JST-PH-2-THM-RA = drill 0.8 pad 1.422: 1 1,0; 2 -1,0
DIOM5127X229N = smd 2.2 x 1.55: 1 -2.05,0; 2 2.05,0
ESP32S3WROOM1UN16 = smd 1.5 x 0.9: 1 -8.75,8.41; 2 -8.75,7.14; 3 -8.75,5.87; 4 -8.75,4.6; 5 -8.75,3.33; 6 -8.75,2.06; 7 -8.75,0.79; 8 -8.75,-0.48; 9 -8.75,-1.75; 10 -8.75,-3.02; 11 -8.75,-4.29; 12 -8.75,-5.56; 13 -8.75,-6.83; 14 -8.75,-8.1; 27 8.75,-8.1; 28 8.75,-6.83; 29 8.75,-5.56; 30 8.75,-4.29; 31 8.75,-3.02; 32 8.75,-1.75; 33 8.75,-0.48; 34 8.75,0.79; 35 8.75,2.06; 36 8.75,3.33; 37 8.75,4.6; 38 8.75,5.87; 39 8.75,7.14; 40 8.75,8.41 | smd 0.9 x 1.5: 15 -6.985,-9.35; 16 -5.715,-9.35; 17 -4.445,-9.35; 18 -3.175,-9.35; 19 -1.905,-9.35; 20 -0.635,-9.35; 21 0.635,-9.35; 22 1.905,-9.35; 23 3.175,-9.35; 24 4.445,-9.35; 25 5.715,-9.35; 26 6.985,-9.35 | smd 0.9 x 0.9: 41 -1.5,0.69; 42 -1.5,2.09; 43 -2.9,2.09; 44 -2.9,0.69; 45 -2.9,-0.71; 46 -1.5,-0.71; 47 -0.1,-0.71; 48 -0.1,0.69; 49 -0.1,2.09
SOT95P280X145-6N = smd 1.2 x 0.6: 1 -1.25,0.95; 2 -1.25,0; 3 -1.25,-0.95; 4 1.25,-0.95; 5 1.25,0; 6 1.25,0.95
SOT230P700X180-4N = smd 1.75 x 0.95: 1 -3.15,2.3; 2 -3.15,0; 3 -3.15,-2.3 | smd 1.75 x 3.2: 4 3.15,0
DPS368XTSA1 = smd 0.35 x 0.35: 1 0.725,0.975; 2 0.725,0.325; 3 0.725,-0.325; 4 0.725,-0.975; 5 -0.725,-0.975; 6 -0.725,-0.325; 7 -0.725,0.325; 8 -0.725,0.975
LSM6DSV16BXTR = smd 0.6 x 0.3: 1 -1.15,0.75; 2 -1.15,0.25; 3 -1.15,-0.25; 4 -1.15,-0.75; 8 1.15,-0.75; 9 1.15,-0.25; 10 1.15,0.25; 11 1.15,0.75 | smd 0.3 x 0.6: 5 -0.5,-0.9; 6 0,-0.9; 7 0.5,-0.9; 12 0.5,0.9; 13 0,0.9; 14 -0.5,0.9
MMC5983MA = smd 0.3 x 0.45: 1 0.75,1.275; 2 0.25,1.275; 3 -0.25,1.275; 4 -0.75,1.275; 9 -0.75,-1.275; 10 -0.25,-1.275; 11 0.25,-1.275; 12 0.75,-1.275 | smd 0.45 x 0.3: 5 -1.275,0.75; 6 -1.275,0.25; 7 -1.275,-0.25; 8 -1.275,-0.75; 13 1.275,-0.75; 14 1.275,-0.25; 15 1.275,0.25; 16 1.275,0.75
APDS9253001 = smd 0.25 x 0.35: 1 0.475,0.625; 3 0.475,-0.625; 4 -0.475,-0.625; 6 -0.475,0.625 | smd 0.25 x 0.3: 2 0.475,0; 5 -0.475,0
BME688 = smd 0.4 x 0.4: 1 1.2,1.2; 2 1.2,0.4; 3 1.2,-0.4; 4 1.2,-1.2; 5 -1.2,-1.2; 6 -1.2,-0.4; 7 -1.2,0.4; 8 -1.2,1.2
MSD4A = smd 0.7 x 1.6: 1 2.25,6.9; 2 1.15,6.9; 3 0.05,6.9; 4 -1.05,6.9; 5 -2.15,6.9; 6 -3.25,6.9; 7 -4.35,6.9; 8 -5.45,6.9; CD1 -6.55,6.9 | smd 1.5 x 1.6: G1 6.85,5.85 | smd 1.2 x 2.2: G2 7.75,-3.7; G3 -7.75,-3.7 | smd 1.2 x 1.8: G4 -7.75,5.6 | hole 1: 3.05,-4.1; -4.95,-4.1
JST04_1MM_RA = smd 0.6 x 1.35: 1 -1.5,0; 2 -0.5,0; 3 0.5,0; 4 1.5,0 | smd 1.2 x 2: NC1 2.8,-3.675; NC2 -2.8,-3.675
GCT_USB4105-GF-A = smd 0.6 x 1.15: A1_B12 -3.2,4.755; A4_B9 -2.4,4.755; B1_A12 3.2,4.755; B4_A9 2.4,4.755 | smd 0.3 x 1.15: A5 -1.25,4.755; A6 -0.25,4.755; A7 0.25,4.755; A8 1.25,4.755; B5 1.75,4.755; B6 0.75,4.755; B7 -0.75,4.755; B8 -1.75,4.755 | drill 0.6 pad 1: SH1 -4.32,4.18; SH2 4.32,4.18; SH3 -4.32,0; SH4 4.32,0 | hole 0.65: 2.89,3.68; -2.89,3.68
2X3-NS = drill 1.016 pad 1.88: 1 -2.54,-1.27; 2 -2.54,1.27; 3 0,-1.27; 4 0,1.27; 5 2.54,-1.27; 6 2.54,1.27
1X05 = drill 1.016 long: 1 -5.08,0; 2 -2.54,0; 3 0,0; 4 2.54,0; 5 5.08,0
1X04 = drill 1.016 long: 1 -3.81,0; 2 -1.27,0; 3 1.27,0; 4 3.81,0
SMT-JUMPER_2_NO_SILK = smd 0.635 x 1.27: 1 -0.406,0; 2 0.406,0
BMRF00060630100MA1 = smd 2.35 x 3.5: 1 -3.025,0; 2 3.025,0
CHIPLED_0805 = smd 1.2 x 1.2: A 0,-1.05; C 0,1.05
RESC1005X40 = smd 0.535 x 0.644: 1 -0.507,0; 2 0.507,0
RESC1608X60 = smd 0.799 x 0.974: 1 -0.815,0; 2 0.815,0
TS1187ABAB = smd 1 x 0.75: A1 -3,1.875; B1 3,1.875; C1 -3,-1.875; D1 3,-1.875
1X07 = drill 1.016 long: 1 -7.62,0; 2 -5.08,0; 3 -2.54,0; 4 0,0; 5 2.54,0; 6 5.08,0; 7 7.62,0
P1-13 = drill 1.321 pad 2.159 octagon: TP 0,0
TESTPOINT_PAD-036 = drill 0.914 pad 1.676: 1 0,0
XCVR_RA-01H = smd 1.536 x 1: 1 -7.682,7; 2 -7.682,5; 3 -7.682,3; 4 -7.682,1; 5 -7.682,-1; 6 -7.682,-3; 7 -7.682,-5; 8 -7.682,-7; 9 7.682,-7; 10 7.682,-5; 11 7.682,-3; 12 7.682,-1; 13 7.682,1; 14 7.682,3; 15 7.682,5; 16 7.682,7

### Placement (x,y rotation side)
AC1  20,45 0 top
C1  1.3,52.15 270 top
C2  2.8,60.5 270 top
C3  8.1,63 0 top
C4  24.67,58.7 0 top
C5  21.87,58.7 180 top
C6  3.8,50.6 180 top
C7  29.4,56 270 top
C8  17.3,58.9 90 top
C9  16.1,58.9 90 top
C10  17.9,47.9 270 top
C11  2.6,1.3 180 top
C12  5.8,1.5 0 top
C13  21.7,4.7 270 top
C14  29.9,11.5 0 top
C15  32,11.5 180 top
C16  23.5,7.5 270 top
C17  19.7,24.3 180 top
C18  9.3,1.5 180 top
C19  9.6,41.95 0 top
C20  31,56 270 top
C21  30.9,58.7 180 top
C22  27.67,58.7 180 top
C23  7.2,41.95 0 top
C24  29.25,47.95 0 top
C25  14.4,47.4 90 top
C26  19.25,41.4 270 top
C27  20.55,41.4 270 top
C28  7,43.76 270 top
C29  7,45.6 90 top
C30  8.5,59.7 180 top
C31  11.5,59.7 180 top
C32  11.5,62.9 180 top
C33  2.8,57.6 90 top
C34  8.5,61.3 180 top
C35  28.6,41.4 180 top
C36  11.5,61.3 180 top
C37  13.17,47.42 90 top
C38  28.95,46 0 top
C39  22.09,49.51 90 top
C40  20.6,35.4 90 top
C41  20.6,32.6 270 top
C42  21.7,38.3 180 top
C43  28.95,44.75 0 top
C44  28.6,42.65 180 top
C45  27,41.1 90 top
C46  23.45,54.8 90 top
CN1  34,55 270 top
CN2  34,48 270 top
CN3  37.5,69.35 0 top
D1  4.9,59.2 270 top
D2  27.95,7.65 0 top
IC1  10,13 90 top
IC2  3.8,53.6 270 top
IC3  19.2,53.3 270 top
IC4  9,44.5 0 top
IC6  14,45 180 top
IC7  26,45 180 top
IC8  26,56 270 top
IC9  26,51 270 top
J1  33,20 90 top
J2  35,33.35 90 top
J3  35,41 90 top
J5  38.28,6.06 90 top
J6  2.85,45.85 90 top
JP1  32,37 90 top
JP2  20.5,69.97 0 top
JP3  33.02,83.22 270 top
JP4  13,96 0 top
JP5  13,92 0 top
L1  9.6,54 270 top
LED1  23.5,10.25 180 top
LED2  31,49 180 top
LED3  26.3,10.1 90 top
LED4  22.58,34.62 0 top
LED5  22.58,30.67 0 top
LED6  22.63,26.81 0 top
R1  21.7,7.5 270 top
R2  1.2,58 270 top
R3  1.2,55.2 270 top
R4  15,2 180 top
R5  32.5,28.9 90 top
R6  33.8,28.9 90 top
R7  28.4,39.6 0 top
R8  28.4,37 0 top
R9  31,46 180 top
R10  31,44.75 0 top
R11  19.7,25.8 180 top
R12  31.7,2.1 270 top
R13  31.95,9.85 270 top
R14  30.2,2.1 270 top
R15  21.95,10.15 90 top
R16  31,51.75 270 top
R17  29.55,10.1 180 top
R18  24.13,35.42 270 top
R19  24.23,31.15 270 top
R20  19.77,28.12 90 top
S1  29.23,62.39 180 top
S2  21.15,62.39 180 top
SIM7600G  3,80.5 270 top
TP1  17,96 0 top
TP2  17,92 0 top
TP3  20.5,92 0 top
TP4  16.98,7 0 top
TP5  38,19 0 top
TP6  16.9,19.3 0 top
TP8  12.1,1.5 0 top
TP9  20.5,96 0 top
TP10  38,6.1 0 top
TP11  35,60 0 top
TP12  24,96 0 top
TP13  24,92 0 top
U1  9.8,32.7 0 top

### Tracks (layer width: path | path; a pad name or v marks a point on that pad's centre or on a via)
3V3  (via drill 0.35)
  Top 0.178: 20.47,31.85 C41.2 | C42.2 20.95,38.17 20.95,37.5 v20.7,37.25 20.6,37.15 C40.2 | JP3.1 33.02,90.84 27.86,96 TP12.TP | 3.2,1.3 C11.1 | AC1.1 v17.9,46 | AC1.15 AC1.14 v20.5,47.1 | C26.1 18.57,41.88 v18.55,41.9 17.82,41.17 17.01,41.17 15,39.16 15,36.6 | C27.1 21.29,41.88 v21.3,41.9 | IC8.4 24.77,56.48 24.6,56.3 v24.6,55.9 | C46.1 23.45,52.75 23.8,52.4 24.5,53.1 v24.5,53.4 24.5,53.3 IC9.6 25.6,51.6 25.4,51.4 26.9,51.4 27.2,51.7 IC9.8 | 19.2,55.9 IC3.2 19.4,56.65 v19.4,59.2 | C44.1 29.09,43.62 28.46,44.23 C43.1 C38.1 27.9,46 v27.5,46.4 | IC6.12 13.5,44.5 13.8,44.8 | IC6.5 14.5,46.82 C25.1 | R5.1 31.69,28.39 v31.6,28.3 | v33.6,62.3 32.5,61.2 22,61.2 21.9,61.1 v21.85,61.15 | U1.3 1,34.58 v1,24.5 | R1.1 21.16,7.47 20.71,7.47 20.32,7.08 20.32,5.48 20,5.16 20,4 20.5,3.5 | v22.45,1.55 22.4,1.6 20.5,1.6 | IC1.2 2.86,17.14 2,18 4.78,20.78 13.22,20.78 16,18 17,18 17.6,17.4 v17.6,13 17.6,12 | v17.6,11.9 v17.6,10.8
  Top 0.2: v14.9,9.8 14.9,5.69 v15.09,5.5
  Top 0.4: 17.6,12 v17.6,11.9 | v15.09,5.5 14.59,5.5 v14.57,5.48
  Top 0.508: 18.21,50.15 IC3.4 17.98,50.15
  Top 1: IC3.2 IC3.4
  Bottom 0.178: JP3.1 35.56,87.03 36.83,85.76 36.83,71.79 33.5,68.46 33.5,62.4 v33.6,62.3 | v24.6,55.9 24.6,53.5 v24.5,53.4 | v27.5,46.4 27.3,46.4 v26,45.1 | v31.6,28.3 31.6,26.8 v31.5,26.7 | v21.85,61.15 20.5,59.8 20,59.8 v19.4,59.2 | v17.6,10.8 17.7,10.9 | v0.9,19.3 0.9,19.5 v1.2,19.8 | 1.2,21 v1.2,20.32 | v1.2,18.8 1.2,19 v1.5,19.3
  Bottom 0.4: v1.6,24.6 1.6,24.3 v1.2,23.9 1.2,24.3 v1,24.5 0.82,24.67 | v1.5,19.3 v0.9,19.3 0.9,19.1 v1.2,18.8 0.82,19.17 0.82,23.58 | 0.82,24.67 0.82,33 | 0.82,33 0.82,35 | 0.82,35 0.82,35.65 v0.88,35.7 0.88,36.68 v0.9,36.7 | 0.82,35 0.88,34.95 v0.88,34.7 | 0.82,33 0.88,32.95 v0.88,32.7 | 0.82,24.67 0.82,23.58 | 1.2,23.2 0.82,23.58 | v21.1,11.6 20.8,11.9 v17.6,11.9 16.4,11.9 v14.9,10.4 | v20.8,13.7 20.1,13 v17.6,13 17,13 15,11 v14.9,11 | v17.6,10.8 15.7,10.8 14.9,10 v14.9,9.8 | v15.09,5.5 14.99,5.4 14.99,3.01 v15.1,2.9 | v14.57,5.48 14.67,5.38 14.67,3.07 v14.5,2.9 | v23,1.6 v21.9,3.5 22.78,2.97 | v23,1.6 22.78,2.97 | 22.78,2.97 v22.5,4.7 v22.5,4.1 v22.45,1.55 v23,1.6
  Bottom 0.5: 17.7,10.9 v21,10.9
  Bottom 1: v1.2,23.9 1.2,23.2 1.2,21 | v1.2,19.8 v1.2,20.32
  pour Top: -3.8,-2 41,-2 45,2 45,42 43.98,43.02 27.16,43.02 27.16,49.84 24.4,52.6 14.5,52.6 9.9,48 -3.8,48
A0  (via drill 0.35)
  Top 0.178: IC1.12 15.56,16.59 15.35,16.8 | 15.35,16.8 15.17,16.98 13.72,16.98 11.75,18.95 6,18.95 v5.95,18.9 | v22.6,24.6 22.6,25.72 LED6.A | v14.85,16.4 15.25,16.8 15.35,16.8 | v7,29.2 7,29.8 4.3,32.5 4.3,40.7 3.8,41.2 3,41.2 1.58,42.62 J6.2
  Bottom 0.178: v22.6,24.6 22.6,23.72 20,21.12 16.51,21.12 14.85,19.46 v14.85,16.4 | v5.95,18.9 5.95,20.3 7.05,21.4 7.05,29.15 v7,29.2
A1  (via drill 0.35)
  Top 0.178: v23.65,29.25 22.96,29.25 LED5.A | IC1.17 16.95,8.56 16,9.5 16,16.75 15.88,16.88 | 15.88,16.88 15.4,17.35 13.9,17.35 11.9,19.35 6.9,19.35 v6.75,19.5 | 15.88,16.88 15.88,16.94 v15.73,17.08 | v7.7,29.2 7.5,29.4 7.5,29.9 4.7,32.7 4.7,40.9 3.9,41.7 3.3,41.7 2.9,42.1 2.9,44.5 1.58,45.82 J6.4
  Bottom 0.178: v23.65,29.25 23.85,29.05 23.85,23.9 17.4,17.45 16.1,17.45 v15.73,17.08 | v6.75,19.5 6.75,20.45 7.45,21.15 7.45,28.95 v7.7,29.2
A2  (via drill 0.35)
  Top 0.178: v24,33.5 22.65,33.5 LED4.A | IC1.18 17.02,9.83 16.45,10.4 16.45,16 16.47,16.02 v16.47,16.2 16.47,17 15.82,17.66 14.2,17.66 12.1,19.75 7.7,19.75 v7.6,19.85 | v8.4,29.2 8.4,29.6 5.1,32.9 5.1,41.2 v4.6,41.7
  Bottom 0.178: v24,33.5 24.35,33.15 24.35,23.7 16.85,16.2 v16.47,16.2 | v7.6,19.85 7.6,20.55 7.85,20.8 7.85,28.65 v8.4,29.2 | v4.6,41.7 3.5,41.7 2.9,42.3 2.9,47.1 1.55,48.45 J6.6
A3  (via drill 0.35)
  Top 0.178: IC1.6 v7.94,6.22 | v6.45,8.55 5.45,9.55 5.45,12 3.55,13.9 3.55,15.92 4.71,17.08 v5.92,17.08 | v9.1,29.2 9.1,29.5 5.5,33.1 5.5,44.6 4.02,46.08 J6.3
  Bottom 0.178: v7.94,6.22 7.68,6.22 6.45,7.45 v6.45,8.55 | v5.92,17.08 5.94,17.1 6.9,17.1 8.25,18.45 8.25,28.35 v9.1,29.2
A4  (via drill 0.35)
  Top 0.178: IC1.9 11.75,5.6 11.05,6.3 11.05,8.65 10.95,8.75 10.05,8.75 10.04,8.74 7.11,8.74 5.85,10 5.85,12.37 4.97,13.25 4.7,13.25 3.95,14 3.95,15.75 4.75,16.55 v6.7,16.55 | v9.8,29.2 9.8,29.5 5.9,33.4 5.9,46.6 J6.5
  Bottom 0.178: v6.7,16.55 6.93,16.55 8.65,18.28 8.65,28.05 v9.8,29.2
BOOT  (via drill 0.35)
  Top 0.178: TP6.1 16.9,19.75 18.14,20.98 18.14,21.71 IC1.27 18.1,22.1 v19.21,23.22 C17.2 19.19,24.32 R11.2 | S1.B1 v29.21,60.52 S1.A1 | v19.2,30.25 19.2,38.15 v19.45,38.4 | v22.55,41.8 v22.55,46.2
  Bottom 0.178: v29.21,60.52 29.21,60.36 27.94,59.09 24.13,59.09 22.86,57.82 22.86,56.55 20.32,54.01 20.32,48.93 22.55,46.7 v22.55,46.2 | v19.21,23.22 19.21,30.23 v19.2,30.25 | v19.45,38.4 22.55,41.5 v22.55,41.8
CC1
  Top 0.178: R14.1 30.2,3.4 31.6,4.8 J5.A5
CC2  (via drill 0.35)
  Top 0.178: v31.98,7.43 32.36,7.81 J5.B5 | v31.4,3.8 31.7,3.5 R12.1
  Bottom 0.178: v31.98,7.43 31.4,6.85 v31.4,3.8
EN  (via drill 0.3, 0.35)
  Top 0.178: v4.12,5.44 4.12,4.38 IC1.3 | R4.2 13.99,1.5 TP8.1 | v11.94,13.4 11.94,6.97 v11.59,6.62 12.11,6.1 v12.5,6.1 | v15.88,49.44 15.88,52.1 18.35,54.58 18.35,60.32 18.22,60.45 | 18.22,60.45 v20.3,60.45 24.09,60.45 S2.A1 | 18.22,60.45 S2.B1 | v16.6,43.55 16.6,41.4 11.5,36.3 v11.5,34.7 | C16.2 23.48,7 v22.8,7 | v20.9,7 R1.2 C13.1 21.61,5.09 20.79,5.09 v20.7,5 | v11.5,23.16 v11.5,26.1
  Bottom 0.178: v4.12,5.44 7.77,5.44 9.11,4.11 | TP8.1 11.72,1.5 9.11,4.11 | v11.94,13.4 11.94,14.13 10.29,15.78 10.29,21.94 v11.5,23.16 | v15.88,49.44 16.6,48.71 v16.6,43.55 | v22.8,7 v20.9,7 | v11.5,34.7 v11.5,26.1 | 9.11,4.11 9.11,4.14 v11.59,6.62 | v20.7,5 16.2,5 15.7,5.5 15.7,5.9 15.5,6.1 v12.5,6.1
GND  (via drill 0.3, 0.35)
  Top 0.178: 26.35,17 J1.6 27.55,16.75 v27.6,16.7 | IC1.49 7.91,13.84 v7.87,13.88 | IC1.48 9.31,13.84 v9.27,13.88 | IC1.47 10.71,13.84 v10.67,13.88 | IC1.49 6.9,12.9 v6.86,12.86 | IC1.42 6.89,11.5 v6.86,11.47 | IC1.43 6.89,10.1 v6.86,10.07 | IC1.43 7.91,9.22 v7.87,9.18 | IC1.44 9.31,9.22 v9.27,9.18 | IC1.41 v10,12.19 | v10,12.19 v10,12.2 v10.01,12.2 | IC1.41 v8.61,12.2 | v8.61,12.2 v8.6,12.2 | IC1.41 v8.61,10.8 | v8.61,10.8 v8.6,10.8 | IC1.41 v10,10.81 | v10,10.81 v10,10.8 | IC1.49 v8.61,12.2 | IC1.48 v8.61,12.2 | IC1.42 v8.61,12.2 | IC1.42 v8.61,10.8 | IC1.43 v8.61,10.8 | IC1.44 v8.61,10.8 | IC1.44 9.31,10.12 v10,10.81 | v10,10.81 10.02,10.81 IC1.46 10.69,11.5 v10,12.19 | IC1.45 v10,10.81 | IC1.47 v10.01,12.2 | IC1.48 v10.01,12.2 | 27.93,41.59 C35.2 27.53,41.98 v27.53,42.17 27.18,41.82 | TP4.1 16.98,7.62 | IC1.47 | v36.3,29.4 36.7,29 J1.G2 35.75,27.75 v35,27 | 31.98,1 R12.2 | R12.2 31.79,1.28 | 33.3,2.8 33.3,2.86 | C2.1 2.73,61.2 v1.8,61.2 | R3.2 v1.2,53.5 | C33.1 2.9,56.73 v2.9,55.9 | v3.7,55.9 3.8,55.8 IC2.2 v3.8,53.5 | v5.5,52.2 4.9,52.2 IC2.6 4.75,53.45 v4.8,53.5 | C6.1 v5.5,50.6 | C1.2 v1.3,50.9 | C30.1 C34.1 9.28,62.38 v9.3,62.4 8.7,63 C3.2 | C32.1 v12.28,62.1 C36.1 v12.28,60.5 C31.1 | S2.D1 17.13,64.27 v17.1,64.3 | S2.C1 24.15,65.15 v24.2,65.2 | S1.D1 26.1,64.4 v26.1,65.1 | S1.C1 32.23,65.13 v32.3,65.2 | C21.1 v32.7,58.7 | C20.1 32.17,56.77 v32.2,56.8 | C7.1 v29.4,57.6 | C22.1 28.45,57.84 v28.4,57.8 | C4.1 24.2,58.4 v24.2,57.8 | C5.1 22.5,58.84 v22.5,59.7 | IC3.1 20.55,56.45 v20.5,56.4 | C9.2 16.1,60.1 v16.2,60.2 | C8.2 17,59.69 v17,60.2 | C46.2 23.36,55.2 v22.7,55.2 | IC9.1 27.6,49.8 v27.8,50 | C24.2 29.73,48.77 v29.6,48.9 | LED2.C 31.15,48.1 v32.4,48.1 | C38.2 29.4,46.03 v29.4,46.8
  Top 0.178: C43.2 29.43,44.1 v29.4,44.07 | R10.2 32.15,44.75 v32.2,44.7 | C45.2 27,41.64 27.18,41.82 | C44.2 27.29,41.82 27.18,41.82 | J3.1 v35,38.6 | J2.1 35.21,31.64 v35.21,31.17 | J1.G1 28.75,26.85 v28.8,26.8 | R19.2 25.05,30.33 v25.19,30.2 | R20.2 20.97,28.93 v21,28.9 | C41.1 19.82,33.38 v19.7,33.5 | C40.1 19.69,34.62 v19.67,34.6 | C26.2 19.25,40.25 v19.2,40.2 | C27.2 20.55,40.55 v20.2,40.2 | U1.16 v18.7,39.7 | U1.16 18.1,40.32 v18.1,40.7 | U1.16 17.48,40.62 v17.4,40.7 | U1.16 v16.2,39.7 | U1.16 16.9,39.7 v16.2,39 | U1.16 17,39.22 v17,38.8 | U1.16 17.48,39.02 v17.7,38.8 | U1.16 18.48,38.7 v18.5,38.7 | U1.9 17.48,25.08 v17.1,24.7 | U1.9 17.28,25.5 v16.2,25.5 | U1.9 16.8,25.7 v16.2,26.3 | U1.9 18.38,26.6 v18.6,26.6 | U1.9 17.56,25.7 v18.56,24.7 | R11.1 v20.9,25.8 | C17.1 20.8,24.3 v20.9,24.2 | v3.5,38.4 2.82,38.4 U1.2 2.7,37.7 | J1.G4 28.3,13.15 v28.3,13.4 | C14.1 29.41,12 29.91,12.5 v31.7,12.5 | C15.1 v33.2,11.5 | J1.G3 35.05,12.25 v35,12.3 | R14.2 30.11,1.2 v29,1.2 | R12.2 32,1.28 | 32,1.28 32.41,1.28 v32.7,1 | J5.A1_B12 32.76,2.1 v32.6,2.1 32.6,1.89 32,1.28 | R4.1 v15.51,1.21 v15.5,1.2 | C11.2 1.92,1.5 v1.2,1.5 | IC1.1 0.9,3.56 v0.9,3 | IC1.1 v1.59,5.49 v1.6,5.5 | IC1.1 1.59,4.79 | IC9.7 v26.4,52.9 | IC9.5 24.26,52.2 v24.18,52.12 | IC8.1 26.62,55.02 v26.5,54.9 | AC1.16 19.5,45.4 v20,45 | AC1.13 AC1.12 20.5,45.5 v20,45 | AC1.10 20.5,44.5 v20,45 | AC1.7 v20,45 | AC1.5 18.8,43.98 v18.32,43.5 | v31.2,9.3 31.91,9.3 R13.2 32.03,9.26 v32.6,9.26 J5.B1_A12 | IC7.11 25.75,46.85 v25.6,47 | IC7.9 26.8,46.33 26.8,46.8 v27.1,47.1 | C13.2 21.68,4.24 v20.82,4.24 | C16.1 22.61,7.98 v22.6,8 | R15.2 22,10.71 v22,11.5 | LED3.C 25.2,10.15 v25.2,11.3 | v16,45.3 15.95,45.25 IC6.3 IC6.2
  Top 0.178: IC6.2 IC6.1 15.85,44.25 v16,44.1 | IC6.2 15.95,44.75 v16,44.7 | C37.2 13.17,48.27 v13.5,48.6 | C25.2 14.2,48.09 v14.2,48.6 | IC6.6 IC6.7 13.53,45.87 v13.53,45.2 | C23.2 7.68,41.12 v7.7,41.1 | C28.2 7.47,42.8 v7.7,42.8 | IC4.7 8.88,44.83 v8.9,44.8 | IC4.1 9.72,46.02 v9.8,46.1 | JP5.1 v12.6,93.2 | JP4.1 v12.59,97.29 v12.6,97.3 | C42.1 v23.4,38.3 | C19.2 10.09,41.22 v10.1,41.2 | C29.2 7.62,46.7 v7.7,46.7 | C10.2 18.59,47.41 v18.6,47.4 | R18.2 24.13,34.47 v24.4,34.2 | C39.1 23.07,48.73 v23.1,48.7 | 1.59,22.29 v2.3,23 | IC1.40 2.08,21.26 v2.08,20.6 | v3.37,44.7 2.9,45.17 2.9,46.6 v3.4,47.1 | 8,1.5 C12.2 6.98,1.5 v7.6,0.88 8,1.28 8,1.5 | 8,1.5 C18.2 | v4.69,30.01 5.5,29.2 v5.5,27.6
  Top 0.254: 33.14,2.86 33.3,2.86 J5.A1_B12
  Top 0.4: v6.8,53.97 6.8,54 9.65,54 | 9.65,54 10.41,54 | 10.41,54 v11,54 | v6.8,53.3 v7.49,53.3 | v7.49,53.3 8.13,53.3 | 8.13,53.3 v8.9,53.3 | v8.9,53.3 9.65,53.3 | 9.65,53.3 v10.3,53.3 | 9.65,54.7 10.29,54.7 | 10.29,54.7 11.05,54.7 | 11.05,54.7 v11.7,54.7 | v9.6,55.4 v10.3,55.4 | v10.3,55.4 v11,55.4 11.43,55.4 | 11.43,55.4 v12.4,55.4 | v10.3,53.3 v11,54 | v11,54 v11.7,54.7 | 11.05,54.7 v11.7,55.4 v11.7,54.7 | v10.3,53.97 11.05,54.7 | v9.6,53.3 10.41,54 | v8.9,53.3 9.65,54 | 10.29,54.7 v9.6,53.97 v10.3,53.3 | v10.3,55.4 9.65,54.7 | v9.6,54.7 v8.9,53.97 | v8.9,53.97 8.13,53.3 | v8.2,53.97 v8.9,54.7 | v8.9,54.7 v9.6,55.4 | v7.5,53.97 v7.49,53.3 | v6.8,53.97 v6.8,53.3 | v9.6,55.4 9.63,54 | 9.63,54 9.65,53.3 | v8.9,54.7 8.9,53.88 | 8.9,53.88 v8.9,53.3 | v8.2,53.97 8.13,53.3 | v6.8,53.3 v7.5,53.97 | v6.8,53.97 v7.49,53.3 | v7.5,53.3 v8.2,53.97 | v7.5,53.97 8.13,53.3 | v8.2,53.3 8.9,53.88 | v8.2,53.97 v8.9,53.3 | v8.9,53.97 9.65,53.3 | v10.3,54.7 v11,54 | v10.3,53.3 v10.3,55.4 | v8.9,54.7 9.65,54 | v8.9,54.7 9.65,54.7 | v10.3,55.4 11.05,54.7 | v10.3,54.7 11.43,55.4 | v11,54 11.05,54.7 | v10.3,54.7 v9.6,55.4 | v8.9,54.7 v10.3,55.4 | v11.7,54.7 v12.4,55.4 | v11,54.7 v12.4,55.4 | v10.3,53.97 9.63,54 | v10.3,53.97 9.65,54.7 | v10.3,53.3 11.05,54.7
  Bottom 0.178: 13.66,23.03 13.53,23.03 | v7.87,9.18 8.1,8.95 v8.1,7.87 | v36.3,29.4 35.66,30.04 v34.96,30.04 | v32.6,2.1 32,1.5 32,1 | 5.05,44.24 5.29,44.48 5.29,46.4 | J6.1 4.12,43.95 v3.37,44.7 | v2.3,23 3.51,24.21 3.51,25 3.51,28.51 4.69,29.68 v4.69,30.01 | v5.5,52.2 6.6,53.3 v6.8,53.3 v7.5,53.3 v8.2,53.3 v8.9,53.3 v9.6,53.3 v10.3,53.3 | v10.3,53.97 10.97,53.97 v11,54 | v8.2,53.97 v8.9,53.97 v9.6,53.97 | v10.3,53.97 v10.3,54.7 | v10.3,53.97 v9.6,53.97 | v9.6,53.97 v9.6,54.7 | v9.6,54.7 v10.3,54.7 | v10.3,54.7 v11,54.7 v11.7,54.7 | v11,55.4 v11.7,55.4 v12.4,55.4 | v9.6,54.7 v9.6,55.4 | v20.5,56.4 20.5,55.18 v18.32,53 v17.6,53 16.8,53 v16.4,53.4 v16.4,54.1 16.4,54.8 17.9,54.8 18.3,54.4 v18.3,53.7 17,53.7 v17,54.1 17,54.3 | v23.1,48.7 22,49.8 | v22.7,55.2 22.2,55.2 22,55 v22,54.8 v22,54.1 v22,53.4 v22,52.7 v22,52 21.87,51.87 21.56,51.87 | 21.54,52 v20.92,52 20.92,52.08 20.9,52.1 v20.9,52.6 v20.9,53.3 20.9,54 | 21.36,54.47 21.4,54.5 21.5,54.5 v21.5,53.7 v21.5,53 v21.5,52.35 | 20.9,54 v20.93,53.97 | 20.9,54 21.36,54.47 | 21.36,54.47 v21.43,54.47 | v4.8,53.5 5,53.5 | v6,53.3 4.8,53.3 5,53.5 | 5,53.5 5.47,53.97 v6,53.97
  Bottom 0.2: 4.91,44.09 5.28,43.72 5.28,42.66 4.92,42.3
  Bottom 0.4: J6.1 4.91,44.09 5.05,44.24 | 21.56,51.87 21.54,52 v21.5,52.35
  Bottom 0.5: 5,42.2 4.92,42.3 J6.1
  pour Bottom: -2,103 53,103 arc90 54,104 54,-26 arc90 52,-24 -3,-24 arc90 -2,-23
N$1
  Top 0.178: LED1.C 23.06,9.64 R15.1
N$2  (via drill 0.35)
  Top 0.178: D1.2 v4.9,58.7 | v7.7,62.3 7.62,62.38 C3.1
  Top 1: IC2.1 4.95,54.85 5.4,55.3 5.4,56.65 | 5.4,56.65 5.03,57.02 IC2.1 | 7.79,55.21 L1.1 IC2.1 | 7.79,55.21 7.42,54.85 IC2.1 | 7.79,55.21 6.84,55.21 5.4,56.65
  Top 2.2: L1.1 5.03,57.02 D1.2
  Bottom 0.178: v4.9,58.7 4.9,59.5 v7.7,62.3
N$3
  Top 0.178: R2.2 R3.1 2.37,54.85 IC2.3
N$4
  Top 0.178: LED3.A R17.2
N$6
  Top 0.178: IC7.10 26.25,47.45 26.75,47.95 C24.1
N$7
  Top 0.178: LED4.C 23.27,35.67 23.53,35.93 R18.1
N$8
  Top 0.178: LED5.C 24,31.72 R19.1
N$9
  Top 0.178: LED2.A R16.2
N$11
  Top 0.178: R20.1 22.08,27.3 LED6.C
N$49
  Top 0.178: LED1.A 23.65,11.45 23.65,12.65 24.45,13.45 J1.CD1
PPS  (via drill 0.35)
  Top 0.178: JP2.5 26.2,70.59 29.62,70.53 29.63,70.55 v29.83,70.55 | v10.46,7.45 10.46,4.27 IC1.8 | v36.83,41.31 36.83,60.99 33.91,63.92 33.91,65.4 v32.5,66.81
  Bottom 0.178: v36.83,41.31 36.83,33.69 33.59,30.45 30.93,30.45 27.44,26.96 27.44,25.05 10.94,8.55 10.94,7.93 v10.46,7.45 | v32.5,66.81 29.83,69.48 v29.83,70.55
PWRKEY  (via drill 0.35)
  Top 0.178: SIM7600G.4 4.8,80.5 5.5,81.2 v5.5,84.1 | v6.2,90 7,90.8 10.8,90.8 11.4,91.4 11.4,94 11.7,94.3 12.9,94.3 13.5,94.9 13.5,96
  Top 0.254: JP4.2 13.5,96 TP1.TP
  Bottom 0.178: v5.5,84.1 5.5,89.3 v6.2,90
RAD_BUSY  (via drill 0.35)
  Top 0.178: IC1.25 20.46,18.72 20.75,19 20.75,22.7 v20.7,22.75 | v16.1,27.6 16.2,27.7 U1.10
  Bottom 0.178: v20.7,22.75 20.7,22.55 19.75,21.6 18.25,21.6 18.05,21.8 18.05,25.6 16.1,27.55 v16.1,27.6
RAD_CS
  Top 0.2: IC1.32 12.05,22.05 12.05,32.47 17.28,37.7 U1.15
RAD_DI
  Top 0.2: IC1.31 12.82,21.95 12.82,31.32 17.2,35.7 U1.14
RAD_DO
  Top 0.2: IC1.30 14.29,23.71 13.6,24.4 13.6,30.47 16.83,33.7 U1.13
RAD_IO1
  Top 0.2: IC1.35 7.94,23.06 4,27 4,28 2.3,29.7 U1.6
RAD_IO2
  Top 0.2: IC1.38 4.13,25.69 U1.7
RAD_IO3
  Top 0.2: IC1.39 2.86,24.96 U1.8
RAD_RST
  Top 0.2: IC1.33 10.48,22.52 6,27 6,29.52 2.12,33.4 U1.4
RAD_RXEN
  Top 0.2: IC1.28 16.83,23.17 15.18,24.82 15.18,29.18 15.7,29.7 U1.11
RAD_SCK
  Top 0.2: IC1.29 15.56,23.44 14.46,24.54 14.46,30.06 16.1,31.7 U1.12
RAD_TXEN
  Top 0.2: IC1.34 9.21,22.79 5,27 5,29 2.3,31.7 U1.5
RX0  (via drill 0.35)
  Top 0.178: JP3.3 31.34,81.95 28.79,79.4 28.79,75.44 26.76,73.41 14.81,73.41 13.5,72.1 13.5,68.4 15.3,66.6 v15.3,65 | v6.48,23.3 6.67,23.11 IC1.36
  Bottom 0.178: v6.48,23.3 6.3,23.3 5,24.6 5,27.95 6.74,29.69 6.74,47.04 7.37,47.66 11.65,47.66 15.49,51.51 15.49,64.81 v15.3,65
RX1  (via drill 0.35)
  Top 0.178: SIM7600G.2 8.22,85.58 v9.1,84.7 | v4.5,14.45 11.62,14.45 13.01,13.06 13.01,7 13.02,6.99 IC1.10 | v18.6,65.2 19.3,65.2 21.9,67.8 21.9,68.83 JP2.4 | v11.8,82 12.1,81.7 12.1,67.5 13.2,66.4 v13.2,65
  Bottom 0.178: v4.5,14.45 3.82,15.13 3.82,28.39 5.6,30.17 5.6,47.51 6.89,48.8 11.18,48.8 14.35,51.98 14.35,63.85 v13.2,65 13.2,65.7 13.7,66.2 16.8,66.2 17.4,65.6 17.4,65.5 17.7,65.2 v18.6,65.2 | v11.8,82 v9.1,84.7
SCL0  (via drill 0.35)
  Top 0.178: IC1.23 20.59,16.17 21.59,17.18 21.59,19.76 26.04,24.21 26.04,30 | 26.04,30 26.04,39.43 26.04,41.56 v24.93,42.67 25.25,43 IC7.1 | v17.85,44.45 17.9,44.5 AC1.4 | v14,43.12 IC6.13 | IC9.4 v24.8,49 24.8,48.15 23.65,47 23.65,43.42 23.35,43.12 v23.25,43.12 | IC8.6 27.12,56.48 27.45,56.15 v27.45,54.4 | 26.04,30 28.6,30 31.1,27.5 34.6,27.5 35.2,28.1 35.2,29.2 35.09,29.31 | 35.09,29.31 34.99,29.41 R6.2 | 35.09,29.31 36.9,31.11 36.9,33.6 35.6,34.9 35,34.9 | v9.1,43 9.62,43.52 IC4.4
  Top 0.254: 35,34.9 J2.4
  Bottom 0.178: v24.93,42.67 24.57,43.03 23,43.03 | 18,43.03 23,43.03 | 18,43.03 14,43.03 | 18,43.03 17.85,43.18 v17.85,44.45 | 14,43.03 v14,43.12 | v27.45,54.4 27.45,50.95 26.9,50.4 25.25,50.4 24.8,49.95 v24.8,49 | 23,43.03 23.08,43.12 v23.25,43.12 | v9.1,43 9.13,43.03 14,43.03
SCL1  (via drill 0.35)
  Top 0.178: IC1.4 5.4,6.07 7.67,8.34 10.12,8.34 v10.32,8.14 | J3.4 35.8,42.5 v36.25,42.05 | v35.65,37.2 35.45,37 JP1.3 R8.2
  Bottom 0.178: v10.32,8.14 10.32,8.44 27.05,25.18 27.05,27.1 29,29.05 29,36 30,37 JP1.3 | v36.25,42.05 36.35,41.95 36.35,37.7 35.85,37.2 v35.65,37.2
SD_CLK
  Top 0.2: IC1.20 20.36,12.36 24,16 24,17 24.85,17.85 J1.5
SD_CS
  Top 0.2: IC1.22 19.91,14.91 22,17 22,18 25,21 25.74,21
  Top 0.25: 25.74,21 arc45 J1.2
SD_DI
  Top 0.2: IC1.21 19.93,13.64 22.5,16.2 22.5,17.9 24.65,20.05 J1.3
SD_DO
  Top 0.2: IC1.19 19.7,11.09 24.25,15.65 J1.7
SDA0  (via drill 0.35)
  Top 0.178: IC1.24 20.46,17.44 21.21,18.2 21.21,19.86 25.65,24.3 25.65,31 | 25.65,31 25.65,40.7 v24,42.35 24,44.05 | IC7.16 24.2,44.25 24,44.05 | v19.95,42.57 19.5,43.02 AC1.6 | v14.7,42.57 14.5,42.77 IC6.14 | 24,44.05 24,46.8 v25.6,48.4 IC9.3 | v28.35,53.05 28.35,56.7 27.8,57.25 26.35,57.25 26,56.9 IC8.5 | 25.65,31 25.2,31 v25.1,31.1 | v27,30.5 28.8,30.5 29.9,29.4 R5.2 32.5,29.7 33.5,30.7 35.4,30.7 36.1,31.4 36.1,33.5 35.75,33.85 J2.3 | v10.8,42.57 10.8,43.6 10.22,44.17 IC4.3
  Bottom 0.178: v24,42.35 23.7,42.65 20,42.65 | 20,42.65 15,42.65 | 20,42.65 19.95,42.6 v19.95,42.57 | 15,42.65 14.92,42.57 v14.7,42.57 | v28.35,53.05 28.35,49.15 27.6,48.4 v25.6,48.4 | v25.1,31.1 26.4,31.1 v27,30.5 | v10.8,42.57 10.88,42.65 15,42.65
SDA1  (via drill 0.35)
  Top 0.178: IC1.5 6.67,5.82 8.12,7.27 8.92,7.27 v9.42,7.77 | J3.3 34.35,41.5 32.39,39.54 JP1.4 | R7.2 28.91,38.91 v28.57,38.58
  Bottom 0.178: v9.42,7.77 9.42,8.01 26.52,25.11 26.52,27.19 28.57,29.25 v28.57,38.58 29.54,39.54 JP1.4
SHLD
  Top 0.178: J5.SH2 31.98,10.38 R13.1
  Bottom 0.178: J5.SH1 J5.SH3 40,3.46 40,8.38 38,10.38 | J5.SH2 38,10.38 | 38,10.38 J5.SH4
SLEEP  (via drill 0.35)
  Top 0.178: SIM7600G.7 4.78,72.88 6.2,74.3 v6.2,76.9 | v6.1,82.3 v6.1,84.8 | v6.6,89.4 7.5,90.3 12.9,90.3 13.41,90.81 JP5.2
  Top 0.254: JP5.2 TP2.TP
  Bottom 0.178: v6.2,76.9 6.2,82.2 v6.1,82.3 | v6.1,84.8 6.1,88.9 v6.6,89.4
TX0  (via drill 0.35)
  Top 0.178: JP3.2 33.02,84.48 28.3,79.76 28.3,75.6 26.51,73.81 14.68,73.81 13.1,72.23 13.1,68.1 14.6,66.6 v14.6,65 | IC1.37 5.6,21.95 v5.6,23.3
  Bottom 0.178: v5.6,23.3 4.6,24.3 4.6,28.09 6.36,29.85 6.36,47.2 7.21,48.04 11.49,48.04 15.11,51.66 15.11,64.49 v14.6,65
TX1  (via drill 0.35)
  Top 0.178: v4.5,15.6 4.6,15.6 5.42,14.78 11.74,14.78 13.4,13.11 13.4,6.1 14.1,5.4 14.1,4.44 IC1.11 | JP2.3 20.5,67 19.2,65.7 v16.4,65.7 | v13.9,65 13.9,66.6 12.6,67.9 12.6,82.4 12,83 v7,83
  Bottom 0.178: v4.5,15.6 4.2,15.9 4.2,28.23 5.98,30.01 5.98,47.35 7.05,48.42 11.33,48.42 14.73,51.82 14.73,64.17 v13.9,65 13.9,65.5 14.1,65.7 v16.4,65.7 | v7,83 3.04,83 SIM7600G.3
USB_N
  Top 0.2: 16.83,4.1 IC1.13 | J5.B7 32.99,5.31 32.94,5.26
  Top 0.254: 16.83,4.1 arc90 18.65,2.28 22.12,2.28 arc90 23.8,3.96 arc-90 25.1,5.26 31.75,5.26 32.94,5.26 | J5.B7 34.52,5.31 arc90 35.01,5.8 arc90 34.49,6.31 J5.A7
USB_P
  Top 0.2: 18.1,4.1 IC1.14 | 33.47,5.86 J5.A6 | 32.67,5.81 J5.A6 | J5.A6 32.49,5.81 | J5.A6 arc-90 33.5,5.79
  Top 0.254: 18.1,4.1 arc90 19.37,2.83 21.97,2.83 arc90 23.27,4.13 arc-90 24.94,5.79 31.75,5.79 32.31,5.79 33.5,5.79 | 32.49,5.81 arc-90 32,6.3 arc-90 32.51,6.81 J5.B6
VBUS  (via drill 0.35)
  Top 0.178: D2.2 30.36,8.02 R17.1 30.36,11.48 C14.2 C15.2 | v34.7,7.3 35.2,7.3 arc-90 35.5,7 arc90 36.4,6.1 TP10.TP
  Top 0.508: v32,4.12 v32,4.11 32.45,3.66 J5.A4_B9 | D2.2 30.8,8.45 v32.26,8.45 J5.B4_A9
  Bottom 0.178: v34.7,7.3 33.5,7.3
  Bottom 0.5: 32.9,6.4 33.5,7 33.5,7.3 33.5,7.9
  Bottom 0.508: v32,4.12 32,5.5 32.9,6.4 | 33.5,7.9 32.95,8.45 v32.26,8.45
VCC  (via drill 0.3, 0.35, 0.51)
  Top 0.178: C22.2 26.87,58.78 25.53,58.78 C4.2 | v35.94,85.12 35.94,89.19 v34.29,90.84 | v31.75,90.84 25.16,90.84 TP13.TP
  Top 1: L1.2 13.43,54.8 13.5,54.8 | L1.2 9.6,51 14.4,55.8 | L1.2 6.88,50.98 6.8,50.9 | L1.2 11.28,50.98 12.1,51.8 | L1.2 10.28,50.98 12,52.7
  Top 1.016: v27.95,7.65 D2.1
  Bottom 0.178: v35.94,85.12 36.32,84.74 36.32,71.73 33.2,68.6 33.2,66 v32.5,66 | v34.29,90.84 v31.75,90.84
  Bottom 1.2: v27.95,7.65 27.95,10.95 35,18 35,24 39,28 39,46 36,49 CN2.2
  pour Top: 42.9,46.8 41.4,46.8 41.4,59.6 41,60 41,70 14,70 13,71 13,53.9 25.1,53.9 28.54,50.46 28.54,44 42.9,44
  pour Top: -3,53 -3,49 10,49 14,53 16,55 16,57 13,57 13,54 12,53
VSENSE  (via drill 0.35)
  Top 0.178: IC1.7 9.21,5.43 v8.89,5.75 | R9.2 R10.1 v30.5,43.6 | v26.2,42.3 27,42.3 27.3,42.6 27.3,43.3 27.6,43.6 v28.4,43.6 | v6,15.3 6.2,15.3 8.2,17.3 v9.7,17.3 | v5.9,7.5 4.98,8.42 v4.98,11.8
  Bottom 0.178: v8.89,5.75 7.65,5.75 v5.9,7.5 | v26.2,42.3 25.21,42.3 25.12,42.21 25.03,42.21 21.59,38.77 21.59,33.69 17.78,29.88 16.51,29.88 9.9,23.27 9.9,17.4 9.8,17.3 v9.7,17.3 | v28.4,43.6 v30.5,43.6 | v4.98,11.8 4.98,14.28 v6,15.3
VSIM
  Top 0.4: D1.1 4.35,61.25 3.3,62.3 | D1.1 5.9,62.25 5.9,62.9 | D1.1 6.3,59.85 6.3,59.6 | D1.1 4.9,60.6 4,59.7
  pour Top: -4,105 44.87,105 44.87,72.68 12.18,72.68 12.18,55.15 10.68,53.65 -2.8,53.65 -2.8,96.8 -3,97 -3,101

### Text on the board
tPlace: PWR | SLEEP | 3.3V | GND | VSIM | GND | VCC | GND | GND / RX / TX / PWR / VSIM / GND / SLEEP | UART | 3.3V / TX / RX / GND | Y | SIM7XXX | Z | VCC / GND / TX / RX / PPS | BAT | X | GPS | + | BOOT | EN | VCC | ALS | I2C | + | + | Boost | LDO | ENV | BAT | - | A2 | I2C | A4 | + | + | A3 | ACC | MAG | BARO | IMU | BAT | A1 | - | GND | I2C | 3.3V | A0 | I2C | I2C | I2C | I2C1 | SDA | ANT | SCL | RTC | I2C0 | A2 | GND | LORA | A1 | A0 | y | 3.3V | BOOT | z | x | SD | JLCJLCJLCJLC | SD | USB | ESP32-S3 | GND | RESET | USB C | VBUS
bPlace: PWR | SLEEP | 3.3V | VSIM | GND | VCC | GND / RX / TX / PWR / VSIM / GND / SLEEP | 3.3V / TX / RX / GND | Y | Z | VCC / GND / TX / RX / PPS | X | WALLY | Designed by Shrey Bohra | VCC | BAT | + | A2 | - | BAT | A4 | A1 | + | A3 | - | I2C1 | A0 | Shreya Ramteke | GND | Akshat Tripathi | I2C0 | Abhik Chatterjee | Shrey Bohra | Camillo De Gregorio | ART Avionics | 3.3V | BOOT | Hritik Parmessur | Sharwa Molla | GND | VBUS | RESET | Altitude Record Team